# EAGLE design Nodo_actuador_wa4_v1_b (EAGLE 8.5.1)

## Sheet 1 of 5: FUENTES
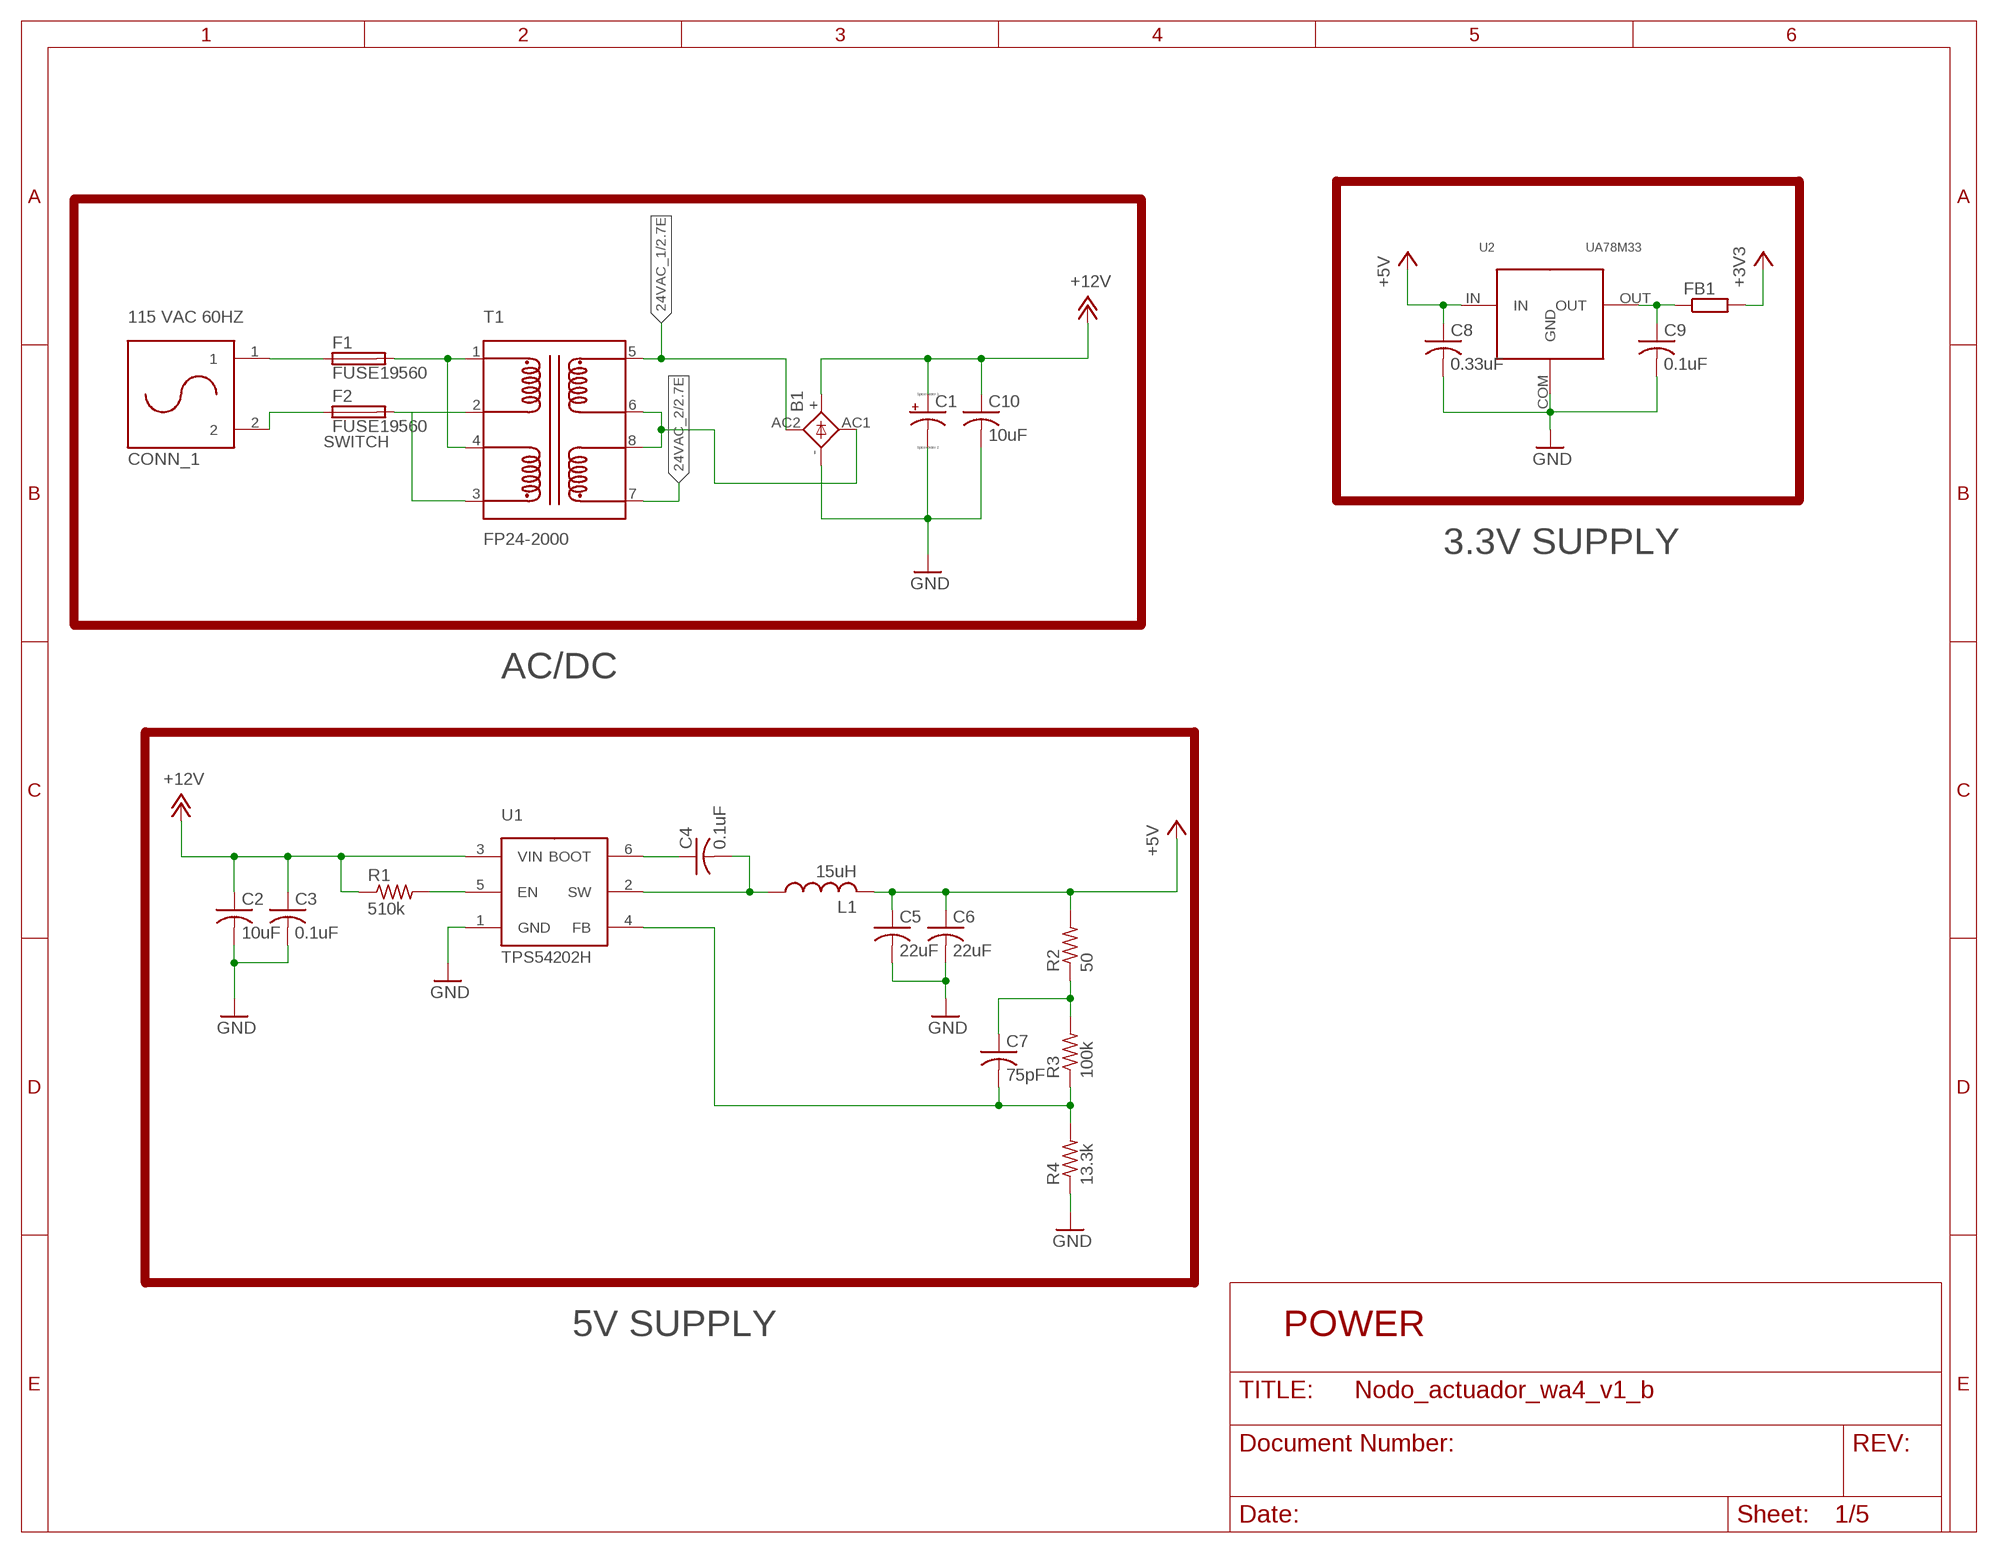
[diagram p0: schematic, sheet 1]

### Parts
B1  GBU4  [GBU4S]
C1  CPOL-USE5-13  [E5-13]
C2  10uF  C-USC0805  [C0805]
C3  0.1uF  C-USC0805  [C0805]
C4  0.1uF  C-USC0805  [C0805]
C5  22uF  C-USC0805  [C0805]
C6  22uF  C-USC0805  [C0805]
C7  75pF  C-USC0805  [C0805]
C8  0.33uF  C-USC0805  [C0805]
C9  0.1uF  C-USC0805  [C0805]
C10  10uF  C-USC0805  [C0805]
CONN_1  115 VAC 60HZ  2570-2210  [2570-2210]
F1  FUSE19560  [19560]
F2  FUSE19560  [19560]
FB1  R-EU_M0805  [M0805]
L1  15uH  VLS5045EX  [VLS5045]
R1  510k  R-US_R0805  [R0805]
R2  50  R-US_R0805  [R0805]
R3  100k  R-US_R0805  [R0805]
R4  13.3k  R-US_R0805  [R0805]
T1  FP24-2000  [FP24-2000]
U1  TPS54202H  [SOT-23-6]
U2  UA78M33  [UA78XX]

### Nets
24VAC_1: B1.AC2(AC1) T1.5 ; also sheet 2
24VAC_2: T1.7 ; also sheet 2
+3V3: FB1.2 ; also sheet 2,3,4
+5V: C5.1 C6.1 C8.1 L1.2 R2.2 U2.IN ; also sheet 2,3,5
+12V: B1.+ C1.+ C2.1 C3.1 C10.1 R1.1 U1.3(VIN) ; also sheet 4
GND: B1.- C1.- C2.2 C3.2 C5.2 C6.2 C8.2 C9.2 C10.2 R4.1 U1.1(GND) U2.COM(GND) ; also sheet 2,3,4,5
N$1: F1.2 T1.1 T1.4
N$2: F2.2 T1.2 T1.3
N$3: B1.AC1(AC2) T1.6 T1.8
N$4: C4.1 U1.6(BOOT)
N$5: C4.2 L1.1 U1.2(SW)
N$6: R1.2 U1.5(EN)
N$8: C7.1 R2.1 R3.2
N$9: C7.2 R3.1 R4.2 U1.4(FB)
N$15: CONN_1.1 F1.1
N$49: CONN_1.2 F2.1
N$53: C9.1 FB1.1 U2.OUT

### Notes on the sheet
- SWITCH
- 3.3V SUPPLY
- AC/DC
- 5V SUPPLY | POWER

## Sheet 2 of 5: VALVULAS Y BOTONERA
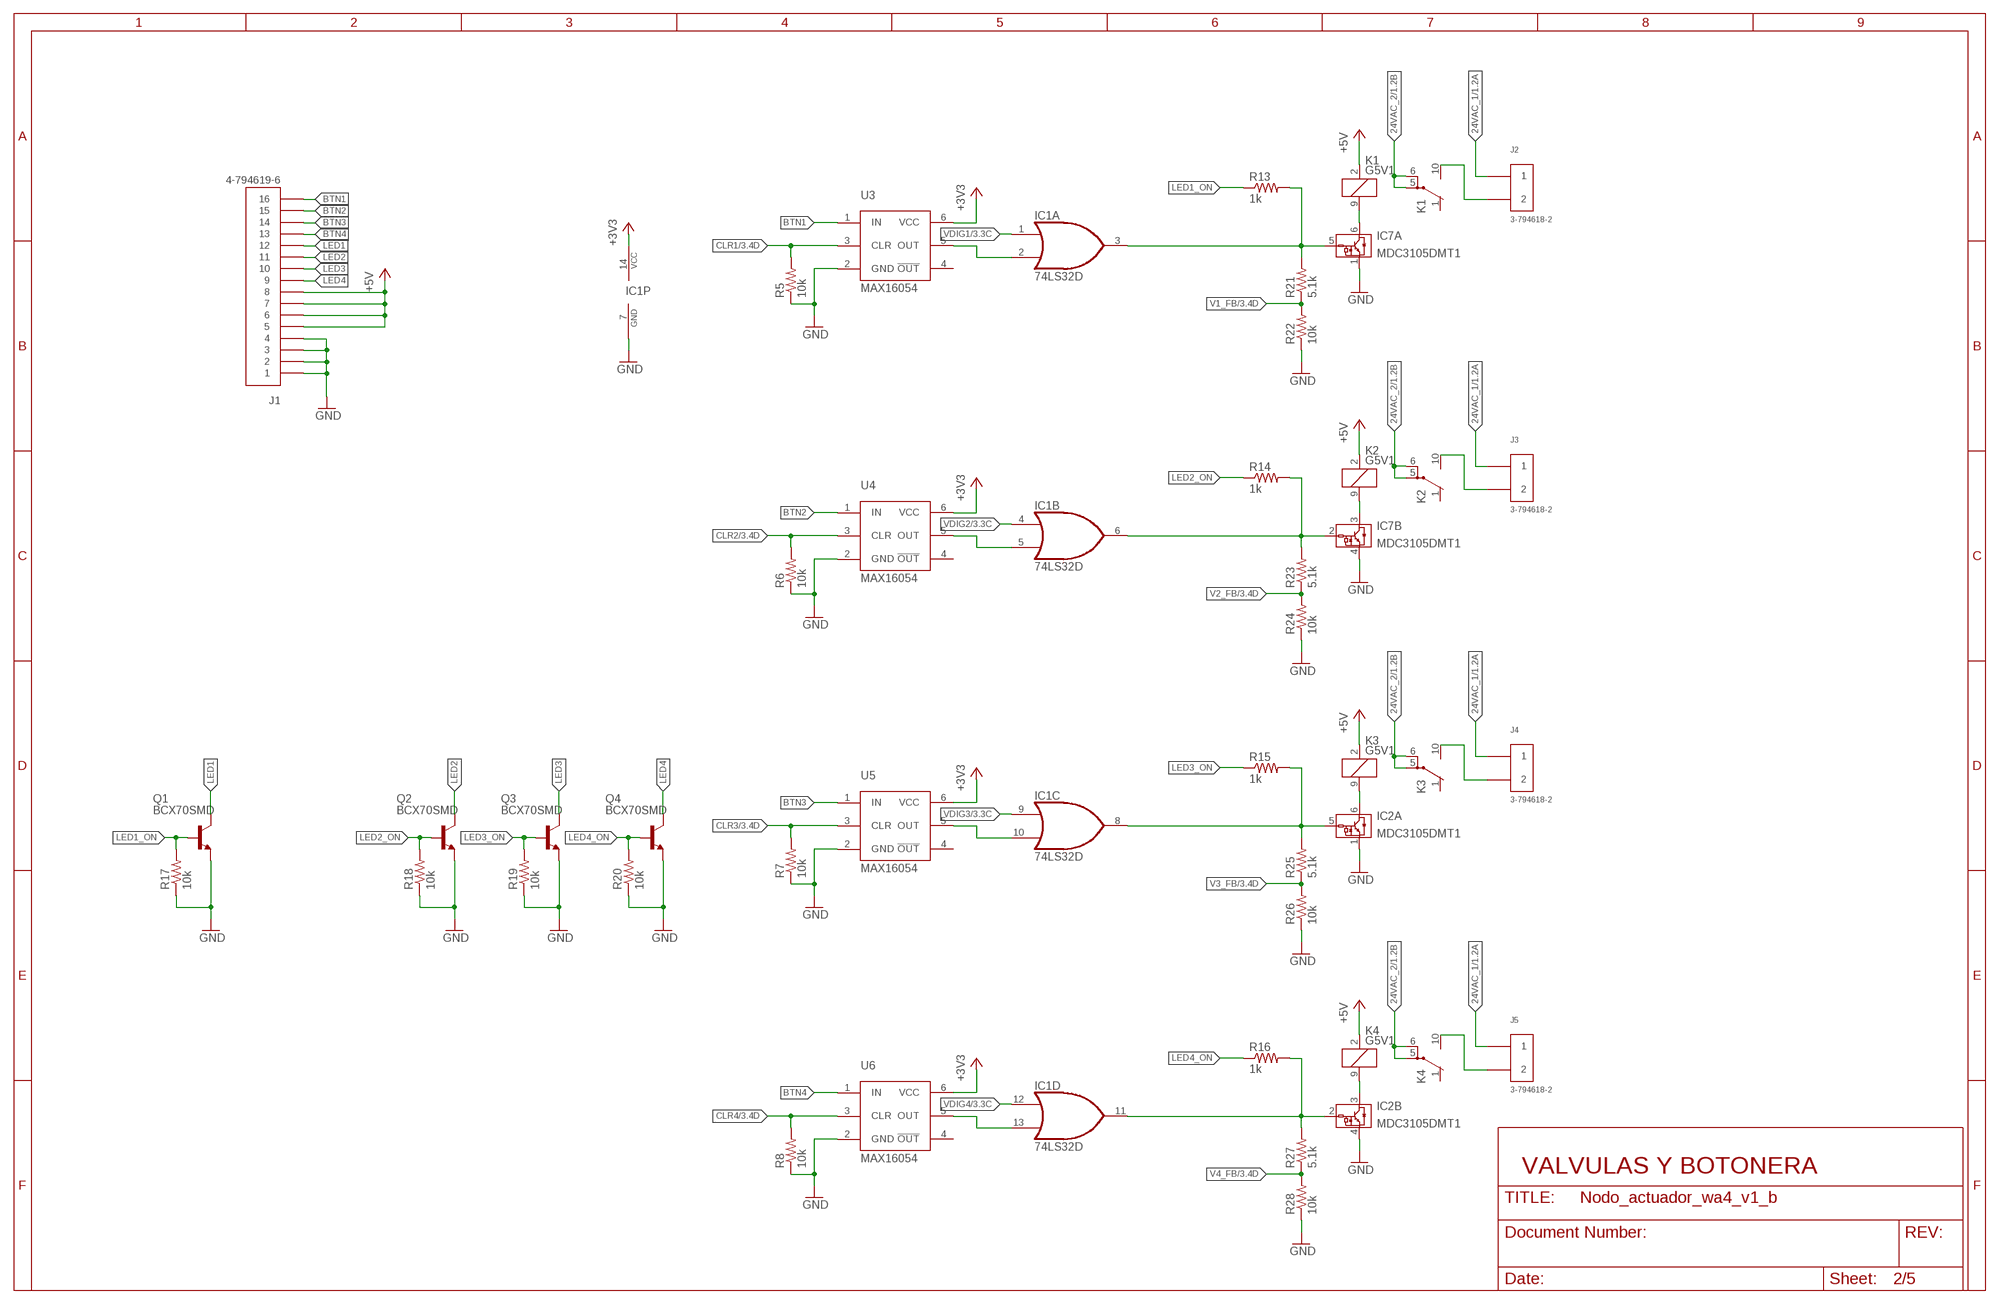
[diagram p1: schematic, sheet 2]

### Parts
IC1  74LS32D  [SO14]
IC2  MDC3105DMT1  [SC-74]
IC7  MDC3105DMT1  [SC-74]
J1  4-794619-6  [4-794619-6]
J2  3-794618-2  [3-794618-2]
J3  3-794618-2  [3-794618-2]
J4  3-794618-2  [3-794618-2]
J5  3-794618-2  [3-794618-2]
K1  G5V1  [G5V1]
K2  G5V1  [G5V1]
K3  G5V1  [G5V1]
K4  G5V1  [G5V1]
Q1  BCX70SMD  [SOT23]
Q2  BCX70SMD  [SOT23]
Q3  BCX70SMD  [SOT23]
Q4  BCX70SMD  [SOT23]
R5  10k  R-US_R0805  [R0805]
R6  10k  R-US_R0805  [R0805]
R7  10k  R-US_R0805  [R0805]
R8  10k  R-US_R0805  [R0805]
R13  1k  R-US_R0805  [R0805]
R14  1k  R-US_R0805  [R0805]
R15  1k  R-US_R0805  [R0805]
R16  1k  R-US_R0805  [R0805]
R17  10k  R-US_R0805  [R0805]
R18  10k  R-US_R0805  [R0805]
R19  10k  R-US_R0805  [R0805]
R20  10k  R-US_R0805  [R0805]
R21  5.1k  R-US_R0805  [R0805]
R22  10k  R-US_R0805  [R0805]
R23  5.1k  R-US_R0805  [R0805]
R24  10k  R-US_R0805  [R0805]
R25  5.1k  R-US_R0805  [R0805]
R26  10k  R-US_R0805  [R0805]
R27  5.1k  R-US_R0805  [R0805]
R28  10k  R-US_R0805  [R0805]
U3  MAX16054  [SOT-23-6]
U4  MAX16054  [SOT-23-6]
U5  MAX16054  [SOT-23-6]
U6  MAX16054  [SOT-23-6]

### Nets
24VAC_1: J2.1 J3.1 J4.1 J5.1 ; also sheet 1
24VAC_2: K1.5(2:P) K1.6(2:P) K2.5(2:P) K2.6(2:P) K3.5(2:P) K3.6(2:P) K4.5(2:P) K4.6(2:P) ; also sheet 1
+3V3: IC1.14(P:VCC) U3.6(VCC) U4.6(VCC) U5.6(VCC) U6.6(VCC) ; also sheet 1,3,4
+5V: J1.5 J1.6 J1.7 J1.8 K1.2 K2.2 K3.2 K4.2 ; also sheet 1,3,5
BTN1: J1.16 U3.1(IN)
BTN2: J1.15 U4.1(IN)
BTN3: J1.14 U5.1(IN)
BTN4: J1.13 U6.1(IN)
CLR1: R5.2 U3.3(CLR) ; also sheet 3
CLR2: R6.2 U4.3(CLR) ; also sheet 3
CLR3: R7.2 U5.3(CLR) ; also sheet 3
CLR4: R8.2 U6.3(CLR) ; also sheet 3
GND: IC1.7(P:GND) IC2.1(A:GND) IC2.4(B:GND) IC7.1(A:GND) IC7.4(B:GND) J1.1 J1.2 J1.3 J1.4 Q1.2(E) Q2.2(E) Q3.2(E) Q4.2(E) R5.1 R6.1 R7.1 R8.1 R17.1 R18.1 R19.1 R20.1 R22.1 R24.1 R26.1 R28.1 U3.2(GND) U4.2(GND) U5.2(GND) U6.2(GND) ; also sheet 1,3,4,5
LED1: J1.12 Q1.3(C)
LED1_ON: Q1.1(B) R13.1 R17.2
LED2: J1.11 Q2.3(C)
LED2_ON: Q2.1(B) R14.1 R18.2
LED3: J1.10 Q3.3(C)
LED3_ON: Q3.1(B) R15.1 R19.2
LED4: J1.9 Q4.3(C)
LED4_ON: Q4.1(B) R16.1 R20.2
N$7: IC1.2(A:I1) U3.5(OUT)
N$10: IC1.5(B:I1) U4.5(OUT)
N$11: IC1.10(C:I1) U5.5(OUT)
N$12: IC1.13(D:I1) U6.5(OUT)
N$13: IC1.3(A:O) IC7.5(A:VIN) R13.2 R21.2
N$14: IC7.6(A:VOUT) K1.9
N$16: IC7.3(B:VOUT) K2.9
N$17: IC1.8(C:O) IC2.5(A:VIN) R15.2 R25.2
N$18: IC2.6(A:VOUT) K3.9
N$19: IC1.11(D:O) IC2.2(B:VIN) R16.2 R27.2
N$20: IC2.3(B:VOUT) K4.9
N$24: J2.2 K1.10(2:S)
N$25: J3.2 K2.10(2:S)
N$26: J4.2 K3.10(2:S)
N$27: J5.2 K4.10(2:S)
N$50: IC1.6(B:O) IC7.2(B:VIN) R14.2 R23.2
V1_FB: R21.1 R22.2 ; also sheet 3
V2_FB: R23.1 R24.2 ; also sheet 3
V3_FB: R25.1 R26.2 ; also sheet 3
V4_FB: R27.1 R28.2 ; also sheet 3
VDIG1: IC1.1(A:I0) ; also sheet 3
VDIG2: IC1.4(B:I0) ; also sheet 3
VDIG3: IC1.9(C:I0) ; also sheet 3
VDIG4: IC1.12(D:I0) ; also sheet 3
Unconnected: K1.1(2:O) K2.1(2:O) K3.1(2:O) K4.1(2:O) U3.4(!OUT) U4.4(!OUT) U5.4(!OUT) U6.4(!OUT)

### Notes on the sheet
- VALVULAS Y BOTONERA

## Sheet 3 of 5: ARDUINO Y COMUNICACION
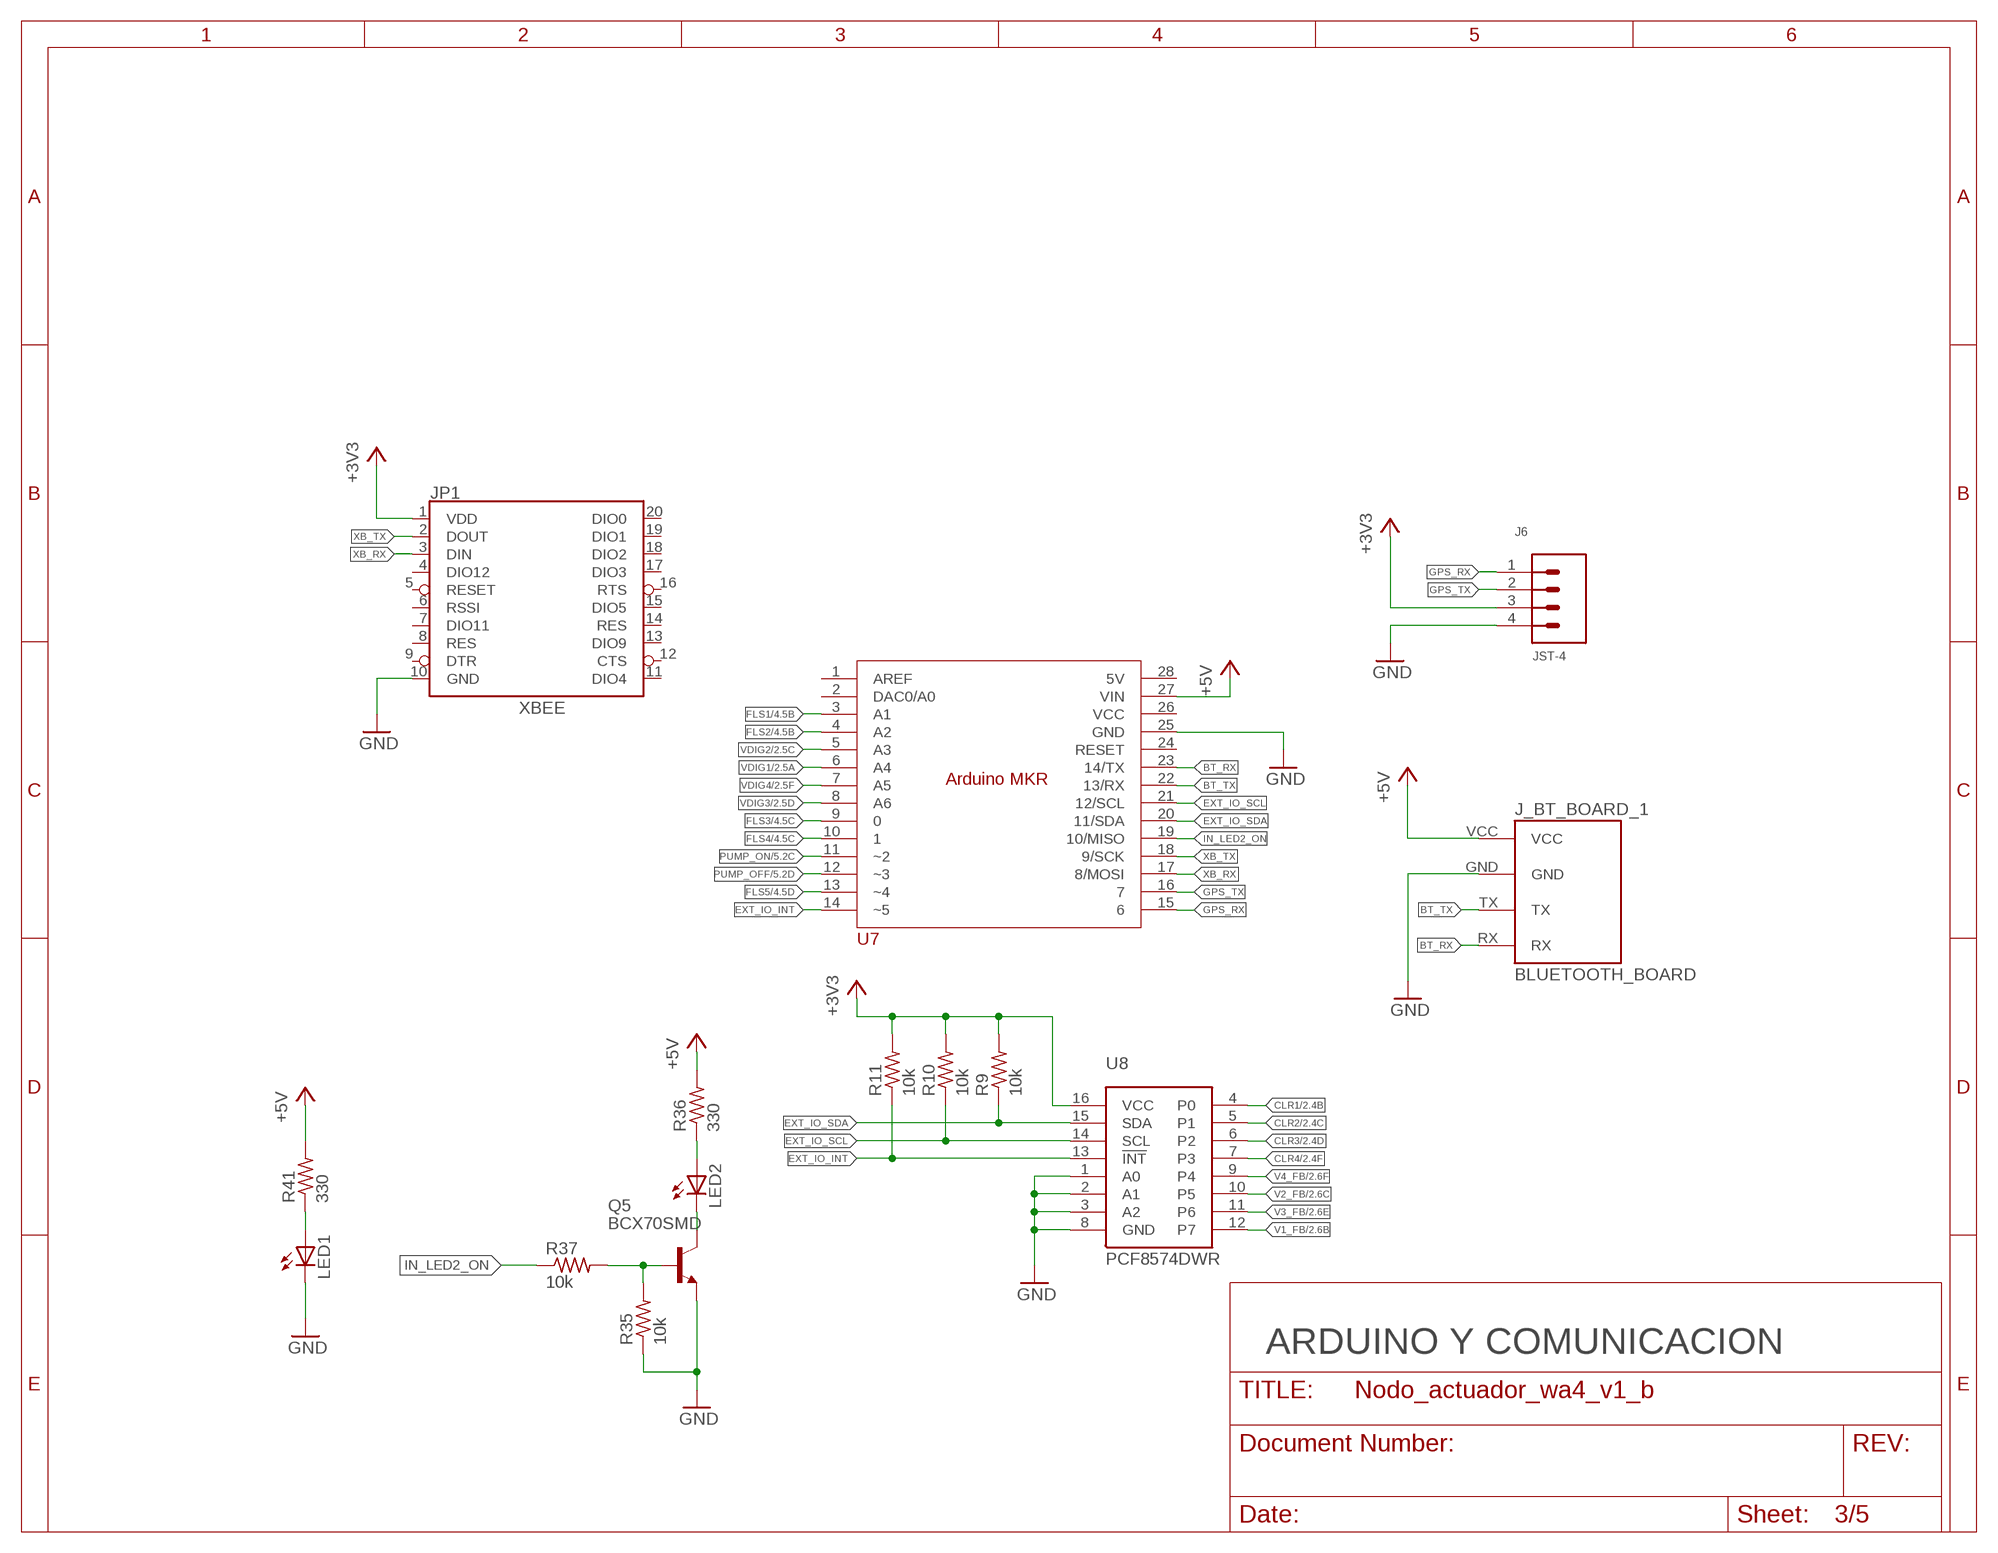
[diagram p2: schematic, sheet 3]

### Parts
J6  JST-4  [JST-4]
J_BT_BOARD_1  BLUETOOTH_BOARD  [BT_BOARD_FOOTPRINT]
JP1  XBEESILK  [XBEE-SILK]
LED1  LEDCHIP-LED0805  [CHIP-LED0805]
LED2  LEDCHIP-LED0805  [CHIP-LED0805]
Q5  BCX70SMD  [SOT23]
R9  10k  R-US_R0805  [R0805]
R10  10k  R-US_R0805  [R0805]
R11  10k  R-US_R0805  [R0805]
R35  10k  R-US_R0805  [R0805]
R36  330  R-US_R0805  [R0805]
R37  10k  R-US_R0805  [R0805]
R41  330  R-US_R0805  [R0805]
U7  ARDUINO_MKR  [ARDUINO_MKR]
U8  PCF8574DWR  [SOIC16_1]

### Nets
+3V3: J6.3 JP1.1(VDD) R9.2 R10.2 R11.2 U8.16(VCC) ; also sheet 1,2,4
+5V: J_BT_BOARD_1.VCC R36.2 R41.2 U7.27(VIN) ; also sheet 1,2,5
BT_RX: J_BT_BOARD_1.RX U7.23(14/TX)
BT_TX: J_BT_BOARD_1.TX U7.22(13/RX)
CLR1: U8.4(P0) ; also sheet 2
CLR2: U8.5(P1) ; also sheet 2
CLR3: U8.6(P2) ; also sheet 2
CLR4: U8.7(P3) ; also sheet 2
EXT_IO_INT: R11.1 U7.14(~5) U8.13(!INT)
EXT_IO_SCL: R10.1 U7.21(12/SCL) U8.14(SCL)
EXT_IO_SDA: R9.1 U7.20(11/SDA) U8.15(SDA)
FLS1: U7.3(A1) ; also sheet 4
FLS2: U7.4(A2) ; also sheet 4
FLS3: U7.9 ; also sheet 4
FLS4: U7.10 ; also sheet 4
FLS5: U7.13(~4) ; also sheet 4
GND: J6.4 J_BT_BOARD_1.GND JP1.10(GND) LED1.C Q5.2(E) R35.1 U7.25(GND) U8.1(A0) U8.2(A1) U8.3(A2) U8.8(GND) ; also sheet 1,2,4,5
GPS_RX: J6.1 U7.15
GPS_TX: J6.2 U7.16
IN_LED2_ON: R37.1 U7.19(10/MISO)
N$38: LED2.A R36.1
N$39: LED2.C Q5.3(C)
N$40: LED1.A R41.1
N$48: Q5.1(B) R35.2 R37.2
PUMP_OFF: U7.12(~3) ; also sheet 5
PUMP_ON: U7.11(~2) ; also sheet 5
V1_FB: U8.12(P7) ; also sheet 2
V2_FB: U8.10(P5) ; also sheet 2
V3_FB: U8.11(P6) ; also sheet 2
V4_FB: U8.9(P4) ; also sheet 2
VDIG1: U7.6(A4) ; also sheet 2
VDIG2: U7.5(A3) ; also sheet 2
VDIG3: U7.8(A6) ; also sheet 2
VDIG4: U7.7(A5) ; also sheet 2
XB_RX: JP1.3(DIN) U7.17(8/MOSI)
XB_TX: JP1.2(DOUT) U7.18(9/SCK)
Unconnected: JP1.4(DIO12) JP1.5(RESET) JP1.6(RSSI) JP1.7(DIO11) JP1.8(RES) JP1.9(DTR) JP1.11(DIO4) JP1.12(CTS) JP1.13(DIO9) JP1.14(RES) JP1.15(DIO5) JP1.16(RTS) JP1.17(DIO3) JP1.18(DIO2) JP1.19(DIO1) JP1.20(DIO0) U7.1(AREF) U7.2(DAC0/A0) U7.24(RESET) U7.26(VCC) U7.28(5V)

### Notes on the sheet
- XBEE
- ARDUINO Y COMUNICACION

## Sheet 4 of 5: SENSORES
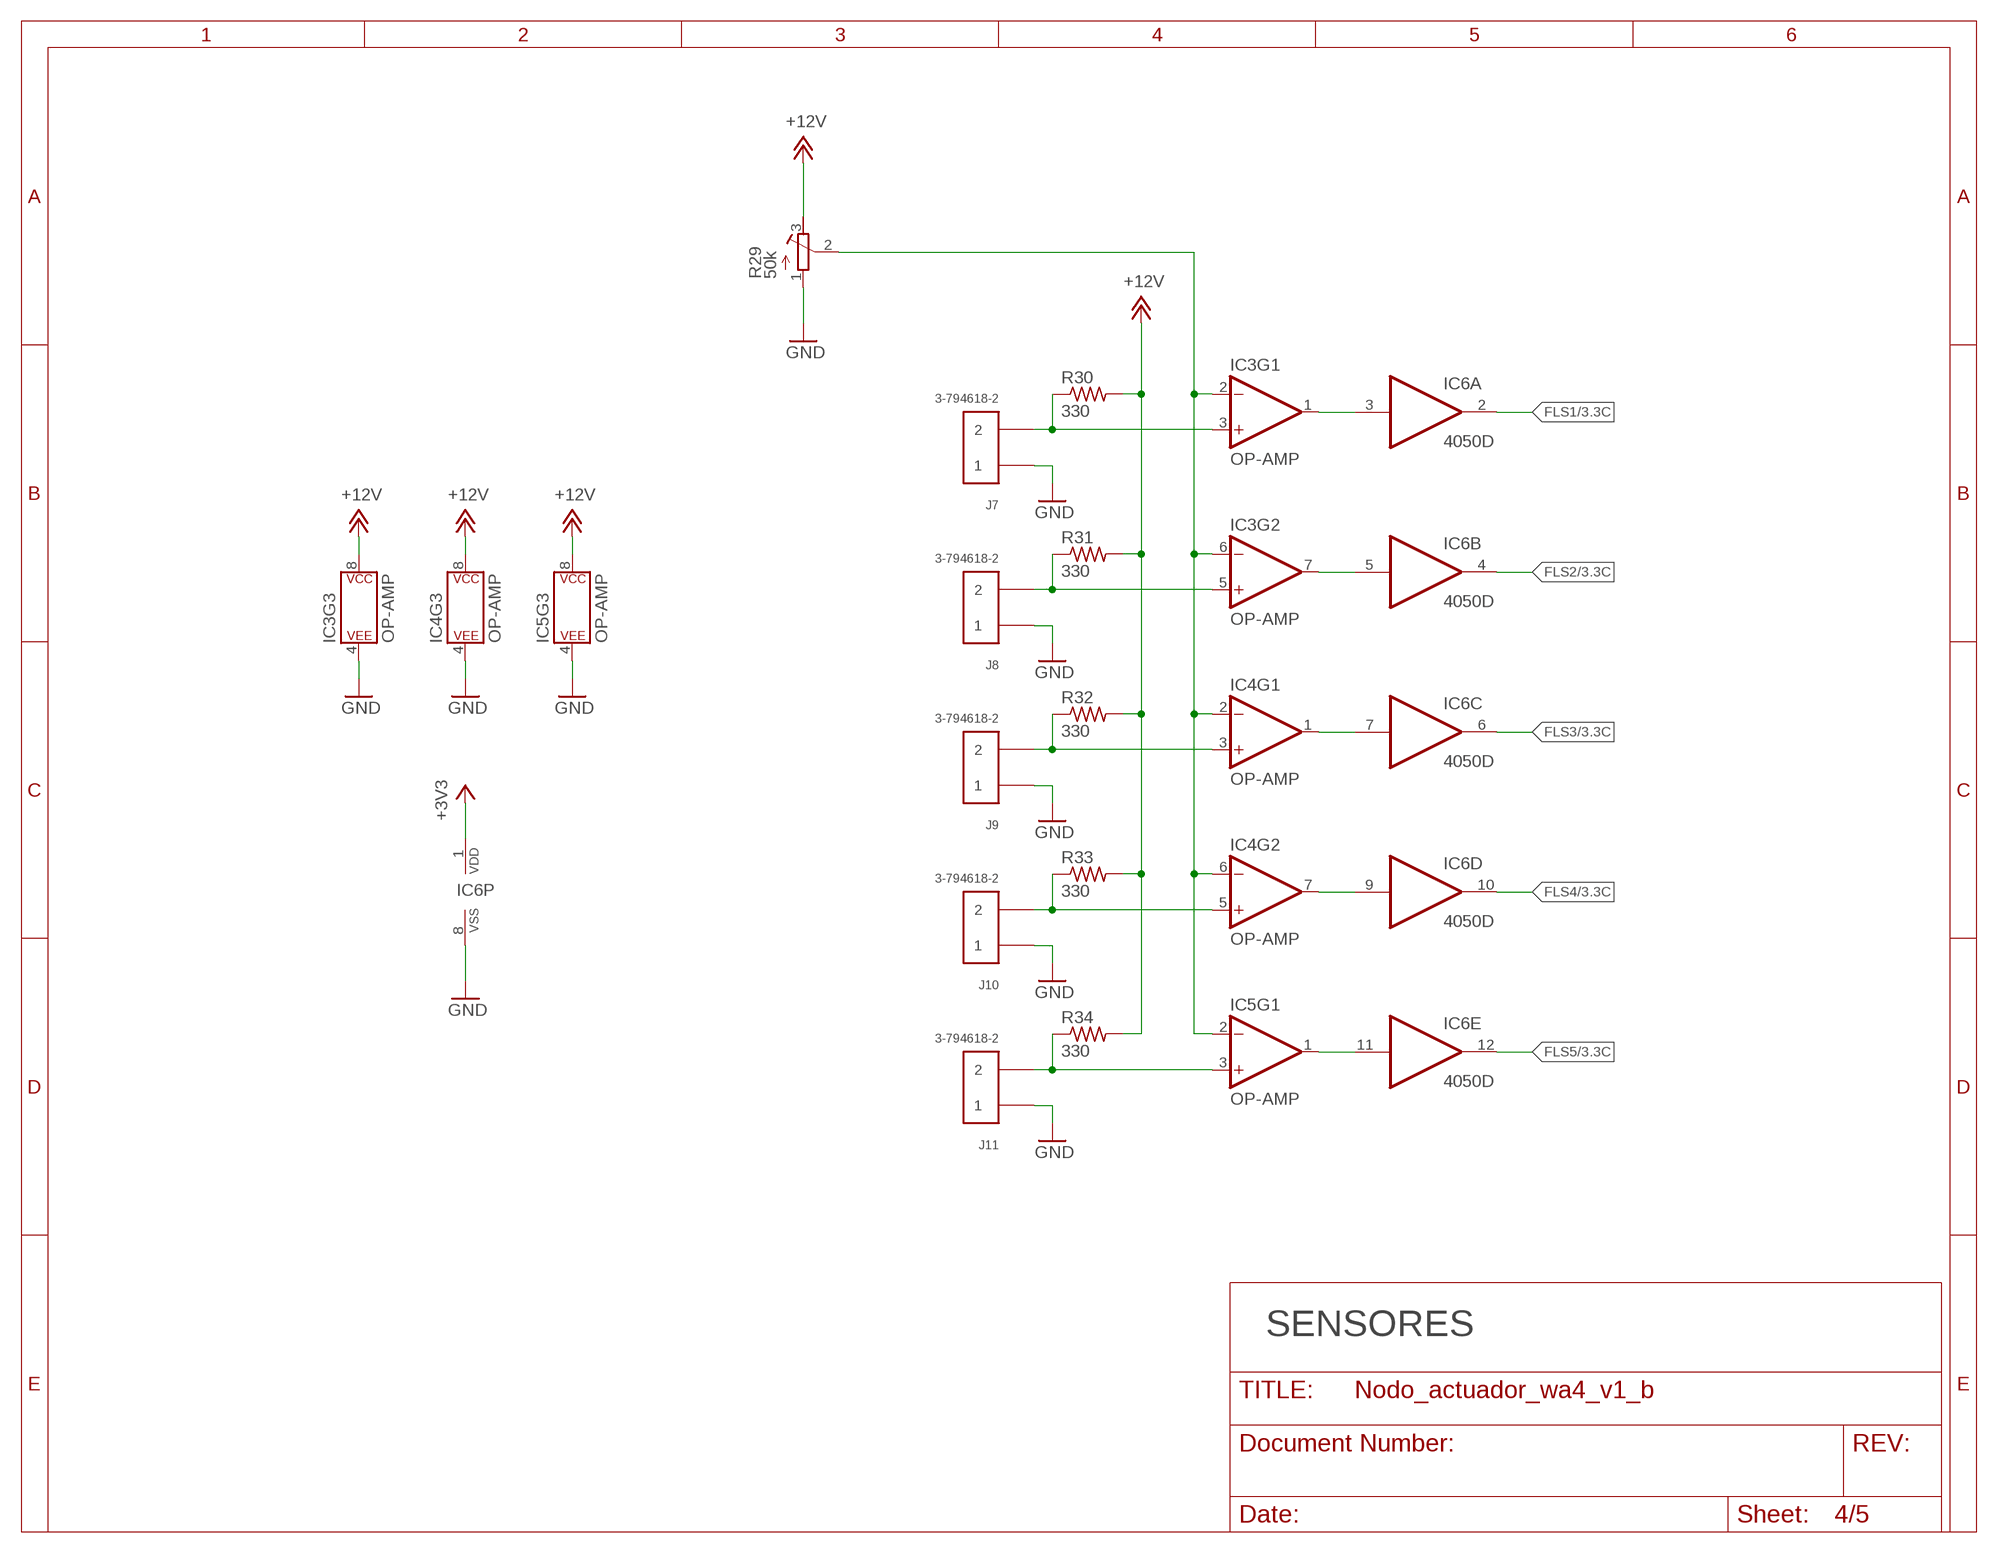
[diagram p3: schematic, sheet 4]

### Parts
IC3  OP-AMP  OPAMP-DUALU  [SO08]
IC4  OP-AMP  OPAMP-DUALU  [SO08]
IC5  OP-AMP  OPAMP-DUALU  [SO08]
IC6  4050D  [SO16]
J7  3-794618-2  [3-794618-2]
J8  3-794618-2  [3-794618-2]
J9  3-794618-2  [3-794618-2]
J10  3-794618-2  [3-794618-2]
J11  3-794618-2  [3-794618-2]
R29  50k  R-TRIMM3224W  [RTRIM3224W]
R30  330  R-US_R0805  [R0805]
R31  330  R-US_R0805  [R0805]
R32  330  R-US_R0805  [R0805]
R33  330  R-US_R0805  [R0805]
R34  330  R-US_R0805  [R0805]

### Nets
+3V3: IC6.1(P:VDD) ; also sheet 1,2,3
+12V: IC3.8(P$V+) IC4.8(P$V+) IC5.8(P$V+) R29.3(E) R30.2 R31.2 R32.2 R33.2 R34.2 ; also sheet 1
FLS1: IC6.2(A:O) ; also sheet 3
FLS2: IC6.4(B:O) ; also sheet 3
FLS3: IC6.6(C:O) ; also sheet 3
FLS4: IC6.10(D:O) ; also sheet 3
FLS5: IC6.12(E:O) ; also sheet 3
GND: IC3.4(P$V-) IC4.4(P$V-) IC5.4(P$V-) IC6.8(P:VSS) J7.1 J8.1 J9.1 J10.1 J11.1 R29.1(A) ; also sheet 1,2,3,5
N$28: IC3.3(+IN) J7.2 R30.1
N$29: IC3.5(+IN) J8.2 R31.1
N$30: IC4.3(+IN) J9.2 R32.1
N$31: IC4.5(+IN) J10.2 R33.1
N$32: IC5.3(+IN) J11.2 R34.1
N$33: IC3.1(OUT) IC6.3(A:I)
N$34: IC3.7(OUT) IC6.5(B:I)
N$35: IC4.1(OUT) IC6.7(C:I)
N$36: IC4.7(OUT) IC6.9(D:I)
N$37: IC5.1(OUT) IC6.11(E:I)
SENSOR_VREF: IC3.2(-IN) IC3.6(-IN) IC4.2(-IN) IC4.6(-IN) IC5.2(-IN) R29.2(S)
Unconnected: IC5.5(+IN) IC5.6(-IN) IC5.7(OUT) IC6.14(F:I) IC6.15(F:O)

### Notes on the sheet
- SENSORES

## Sheet 5 of 5: BOMBA
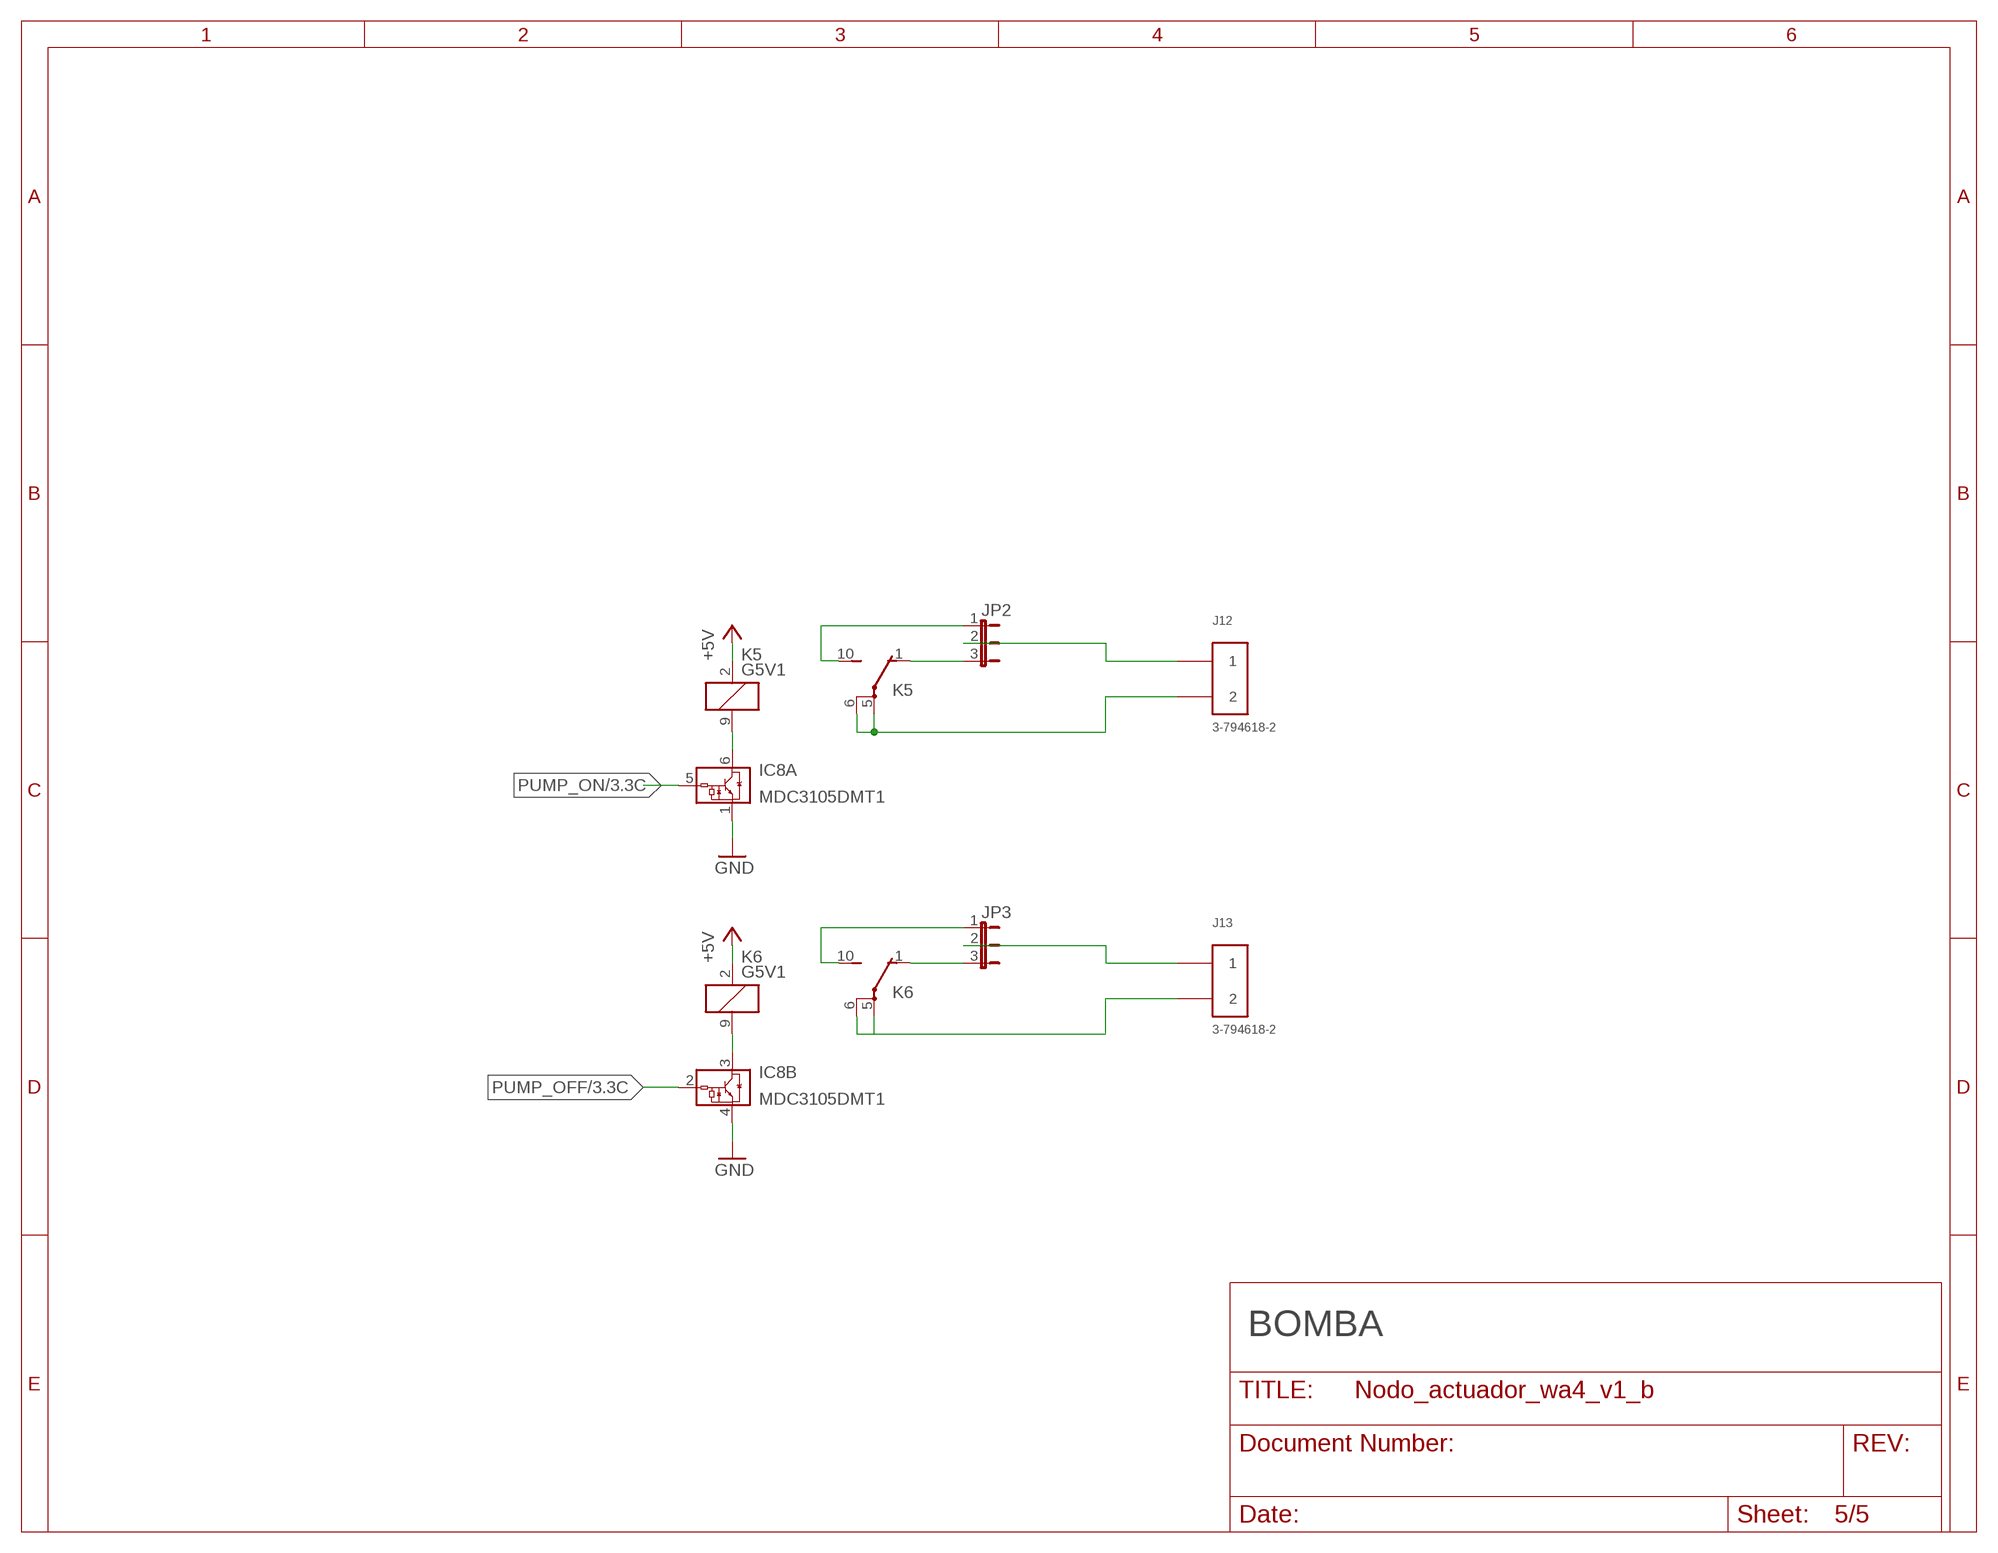
[diagram p4: schematic, sheet 5]

### Parts
IC8  MDC3105DMT1  [SC-74]
J12  3-794618-2  [3-794618-2]
J13  3-794618-2  [3-794618-2]
JP2  JP2E  [JP2]
JP3  JP2E  [JP2]
K5  G5V1  [G5V1]
K6  G5V1  [G5V1]

### Nets
+5V: K5.2 K6.2 ; also sheet 1,2,3
GND: IC8.1(A:GND) IC8.4(B:GND) ; also sheet 1,2,3,4
N$21: IC8.6(A:VOUT) K5.9
N$22: JP2.1 K5.10(2:S)
N$23: JP2.3 K5.1(2:O)
N$41: J12.1 JP2.2
N$42: J12.2 K5.5(2:P) K5.6(2:P)
N$43: J13.1 JP3.2
N$44: J13.2 K6.5(2:P) K6.6(2:P)
N$45: JP3.1 K6.10(2:S)
N$46: JP3.3 K6.1(2:O)
N$47: IC8.3(B:VOUT) K6.9
PUMP_OFF: IC8.2(B:VIN) ; also sheet 3
PUMP_ON: IC8.5(A:VIN) ; also sheet 3

### Notes on the sheet
- BOMBA

## Library data of the parts
B1 = rectifier:GBU4: GENERAL INSTRUMENT RECTIFIER
C1 = resistor:CPOL-US: POLARIZED CAPACITOR, American symbol
C2-C10 = resistor:C-US: CAPACITOR, American symbol
CONN_1 = actuador:2570-2210
F1 F2 = fuse:FUSE: Fuse; MPN: 56000001009; OC_FARNELL: 1185363; OC_NEWARK: 98K6125
FB1 = resistor:R-EU_: RESISTOR, European symbol
IC1 = 74xx-us:74*32: Quad 2-input OR gate
IC2 IC7 IC8 = on-semiconductor:MDC3105DMT1: Integrated Relay, Inductive Load Driver Sopurce: U6 OnSemi Inductive Load Driver MDC3105-D.PDF; MPN: MDC3105DMT1G; OC_FARNELL: unknown; OC_NEWARK: 04R7836
IC3-IC5 = SparkFun-IC-Amplifiers:OPAMP-DUAL: Generic op-amp footprint This component is for the standard 358 pinning of a dual op-amp From the LM358 datasheet: Pin 1: Output A Pin 2: Inverting Input A Pin 3: Non-Inverting Input A Pin 4: Gnd Pin 5: Non-Inverting Input B Pin 6: Inverting Input B Pin 7: Output B Pin 8: V+; PROD_ID: NA-XXXXX
IC6 = 40xx:4050: Hex non-inverting BUFFER
J1 = actuador:4-794619-6
J2-J5 J7-J13 = actuador:3-794618-2
J6 = actuador:JST-4
J_BT_BOARD_1 = Bluetooth HC-05:BLUETOOTH_BOARD: Bluetooth Board V1.05
JP1 = SparkFun-RF:XBEE: Digi XBee and XBee Pro XBees are tiny blue chips that can communicate wirelessly with each other. They can do simple things, like replacing a couple of wires in serial communication, which is nice when you want to make a remote for your paintball vehicle. SparkFun Products SparkFun XBee Buying Guide <https://www.sparkfun.com/pages/xbee_guide> SparkFun XBee Explorer USB <https://www.sparkfun.com/products/11812> (WRL-11812) Breakout Board for XBee Module <https://www.sparkfun.com/products/8276> (WRL-8276) SparkFun XBee Explorer Regulated <https://www.sparkfun.com/products/11373> (WRL-11373) SparkFun XBee Explorer Dongle <https://www.sparkfun.com/products/11697> (WRL-11697) SparkFun XBee Shield <https://www.sparkfun.com/products/12847> (WRL-12847) SparkFun XBee Explorer Serial <https://www.sparkfun.com/products/13225> (WRL-13225)
JP2 JP3 = jumper:JP2E: JUMPER
K1-K6 = relay:G5V1: RELAY 1 x switch, 0.5 A/125 V AC, 1 A/24 V DC , Omron; MPN: G5V-1-DC24; OC_FARNELL: 9949593; OC_NEWARK: 36M6377
L1 = actuador:VLS5045EX
LED1 LED2 = led:LED: LED OSRAM: - CHIPLED LG R971, LG N971, LY N971, LG Q971, LY Q971, LO R971, LY R971 LH N974, LH R974 LS Q976, LO Q976, LY Q976 LO Q996 - Hyper CHIPLED LW Q18S LB Q993, LB Q99A, LB R99A - SideLED LS A670, LO A670, LY A670, LG A670, LP A670 LB A673, LV A673, LT A673, LW A673 LH A674 LY A675 LS A676, LA A676, LO A676, LY A676, LW A676 LS A679, LY A679, LG A679 - Hyper Micro SIDELED® LS Y876, LA Y876, LO Y876, LY Y876 LT Y87S - SmartLED LW L88C, LW L88S LB L89C, LB L89S, LG L890 LS L89K, LO L89K, LY L89K LS L896, LA L896, LO L896, LY L896 - TOPLED LS T670, LO T670, LY T670, LG T670, LP T670 LSG T670, LSP T670, LSY T670, LOP T670, LYG T670 LG T671, LOG T671, LSG T671 LB T673, LV T673, LT T673, LW T673 LH T674 LS T676, LA T676, LO T676, LY T676, LB T676, LH T676, LSB T676, LW T676 LB T67C, LV T67C, LT T67C, LS T67K, LO T67K, LY T67K, LW E67C LS E67B, LA E67B, LO E67B, LY E67B, LB E67C, LV E67C, LT E67C LW T67C LS T679, LY T679, LG T679 LS T770, LO T770, LY T770, LG T770, LP T770 LB T773, LV T773, LT T773, LW T773 LH T774 LS E675, LA E675, LY E675, LS T675 LS T776, LA T776, LO T776, LY T776, LB T776 LHGB T686 LT T68C, LB T68C - Hyper Mini TOPLED® LB M676 - Mini TOPLED Santana® LG M470 LS M47K, LO M47K, LY M47K Source: http://www.osram.convergy.de LUXEON: - LUMILED® LXK2-PW12-R00, LXK2-PW12-S00, LXK2-PW14-U00, LXK2-PW14-V00 LXK2-PM12-R00, LXK2-PM12-S00, LXK2-PM14-U00 LXK2-PE12-Q00, LXK2-PE12-R00, LXK2-PE12-S00, LXK2-PE14-T00, LXK2-PE14-U00 LXK2-PB12-K00, LXK2-PB12-L00, LXK2-PB12-M00, LXK2-PB14-N00, LXK2-PB14-P00, LXK2-PB14-Q00 LXK2-PR12-L00, LXK2-PR12-M00, LXK2-PR14-Q00, LXK2-PR14-R00 LXK2-PD12-Q00, LXK2-PD12-R00, LXK2-PD12-S00 LXK2-PH12-R00, LXK2-PH12-S00 LXK2-PL12-P00, LXK2-PL12-Q00, LXK2-PL12-R00 Source: www.luxeon.com KINGBRIGHT: KA-3528ASYC Source: www.kingbright.com
Q1-Q5 = transistor-npn:BCX70*: NPN Transistor
R1-R11 R13-R28 R30-R37 R41 = resistor:R-US_: RESISTOR, American symbol
R29 = resistor:R-TRIMM: Trimm resistor
T1 = actuador:FP24-2000
U1 = actuador:TPS54202H
U2 = actuador:UA78M33
U3-U6 = actuador:MAX16054
U7 = Arduino_MKR:ARDUINO_MKR
U8 = actuador:PCF8574DWR

## Board
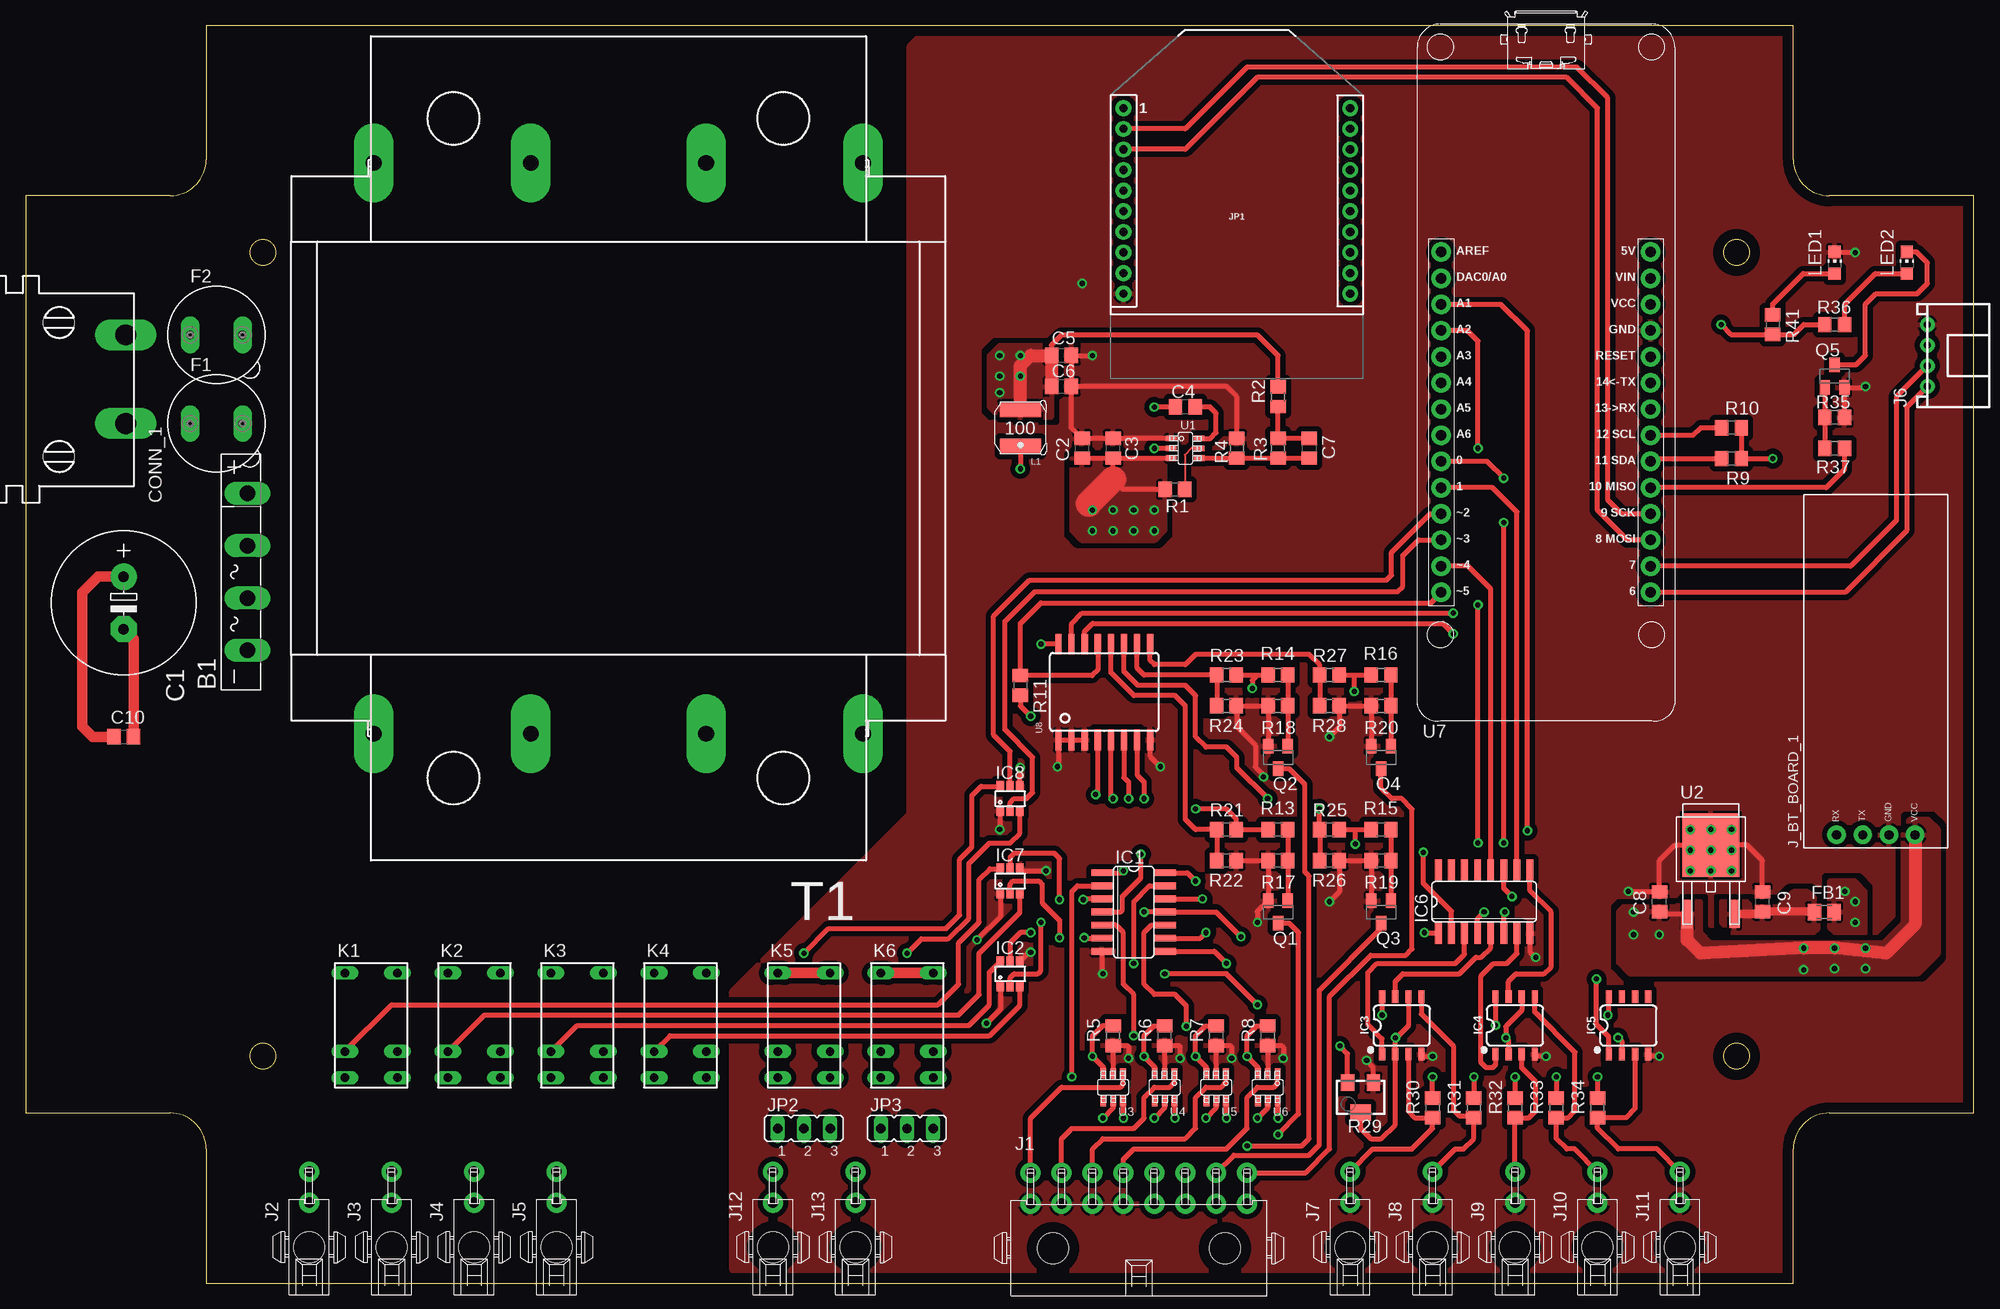
[diagram p5: board, top side]
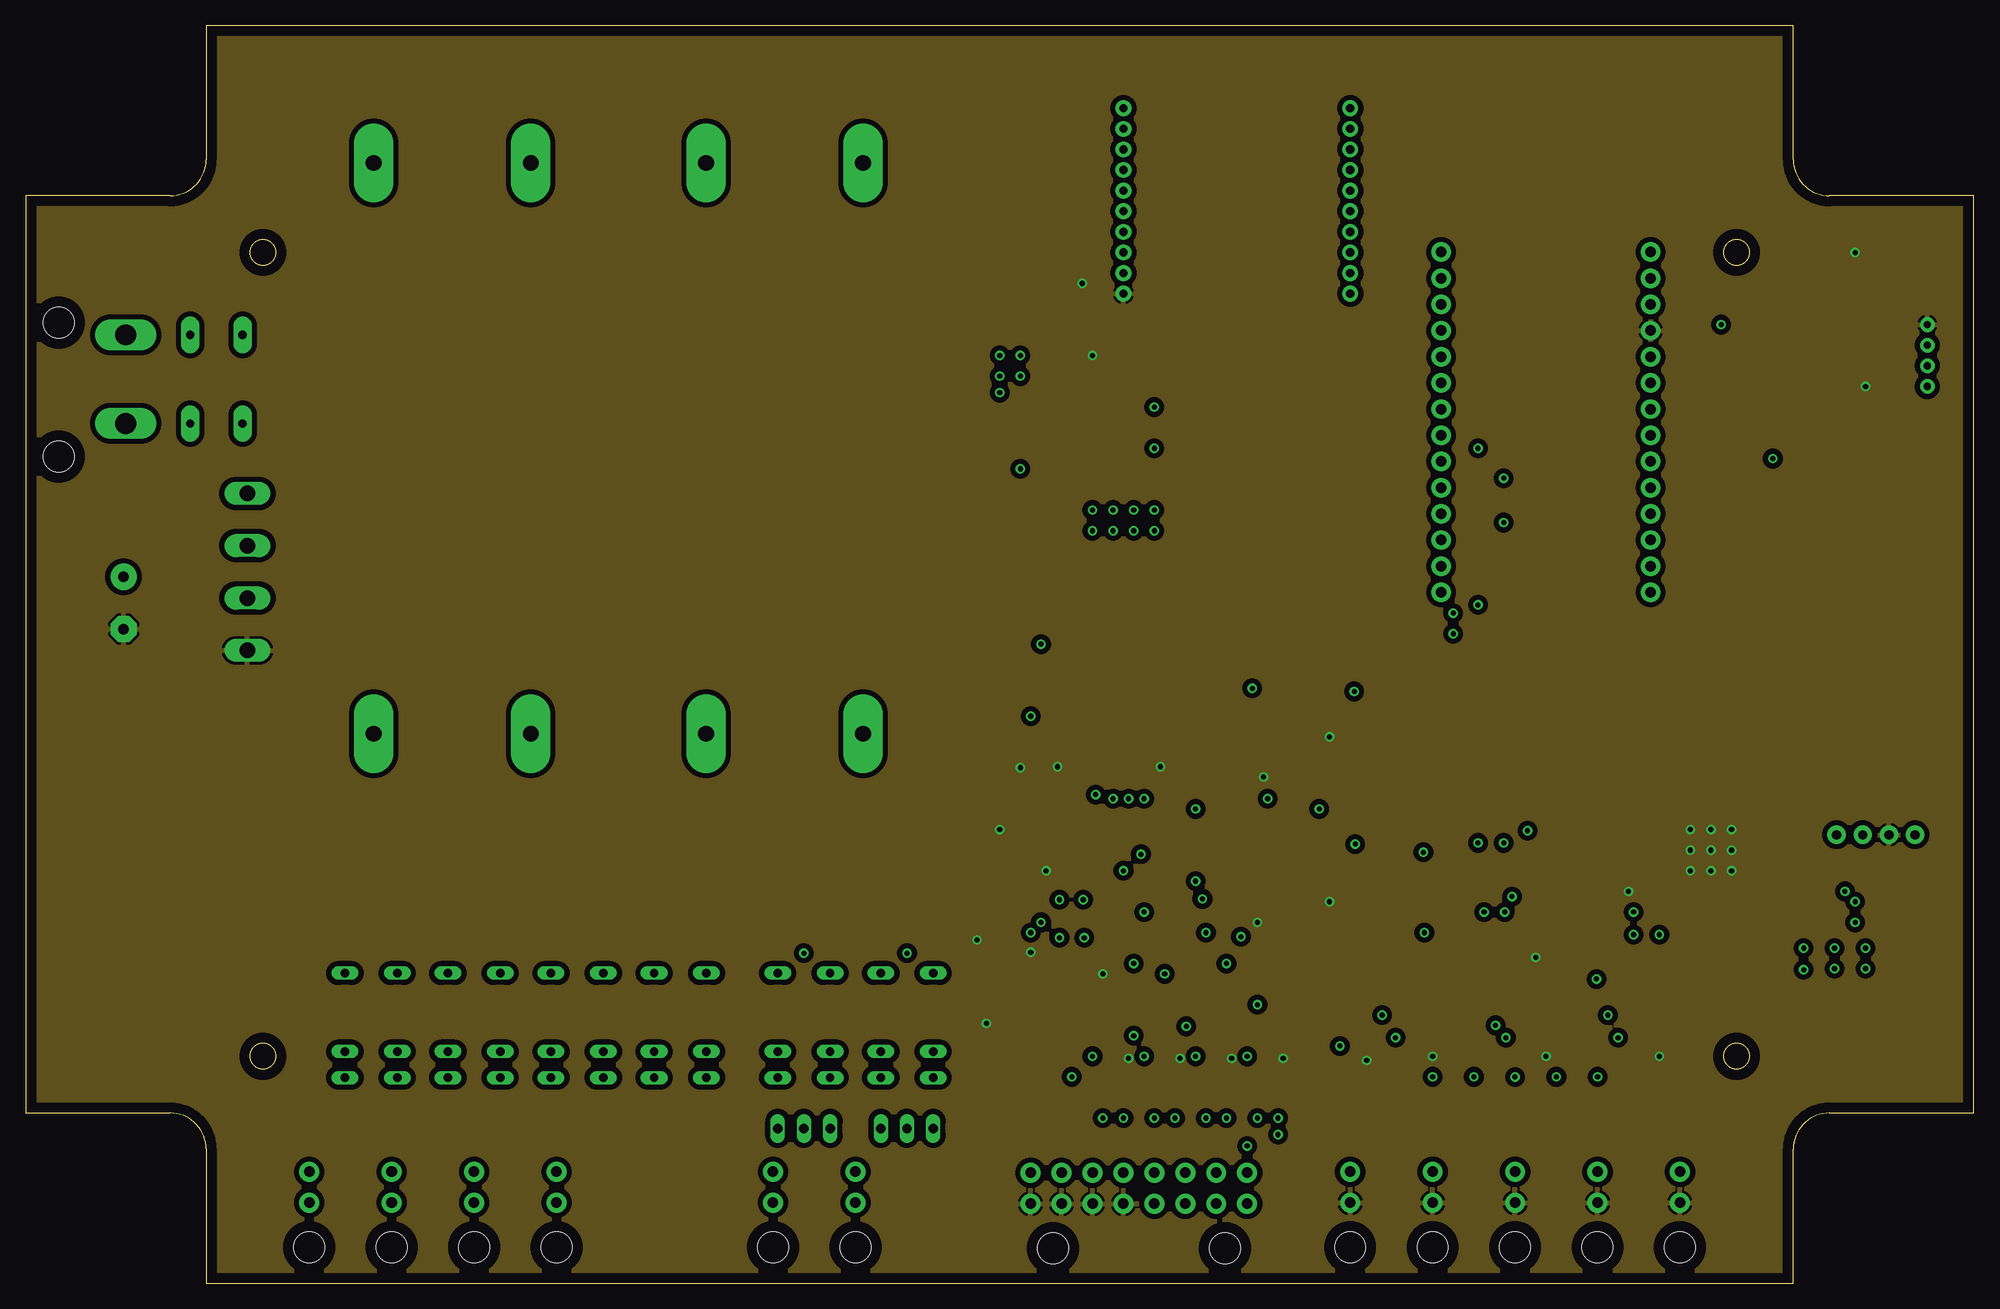
[diagram p6: board, inner layer Ground]
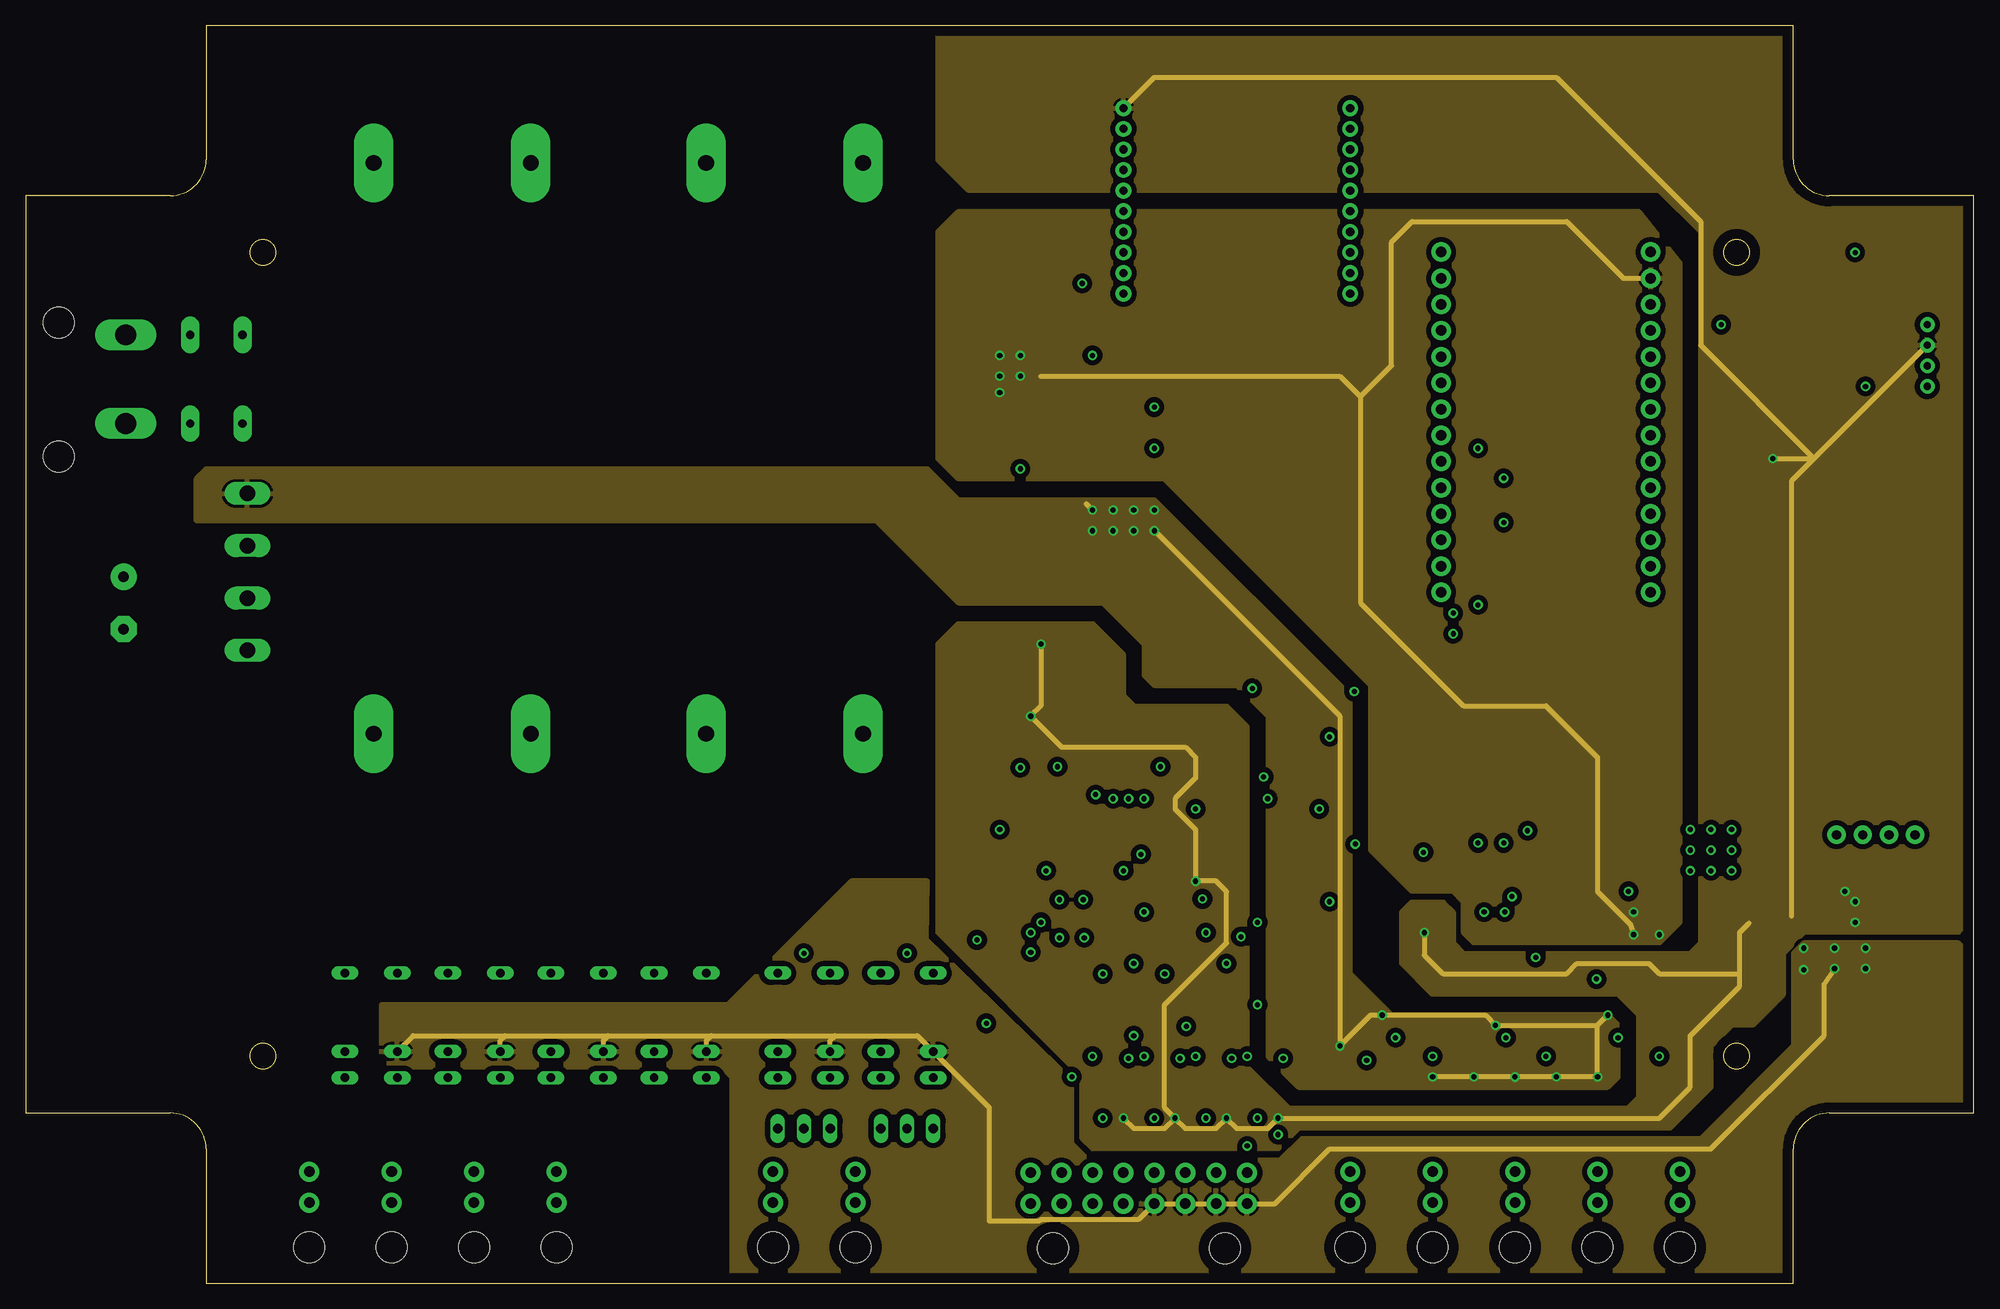
[diagram p7: board, inner layer SUPPLY]
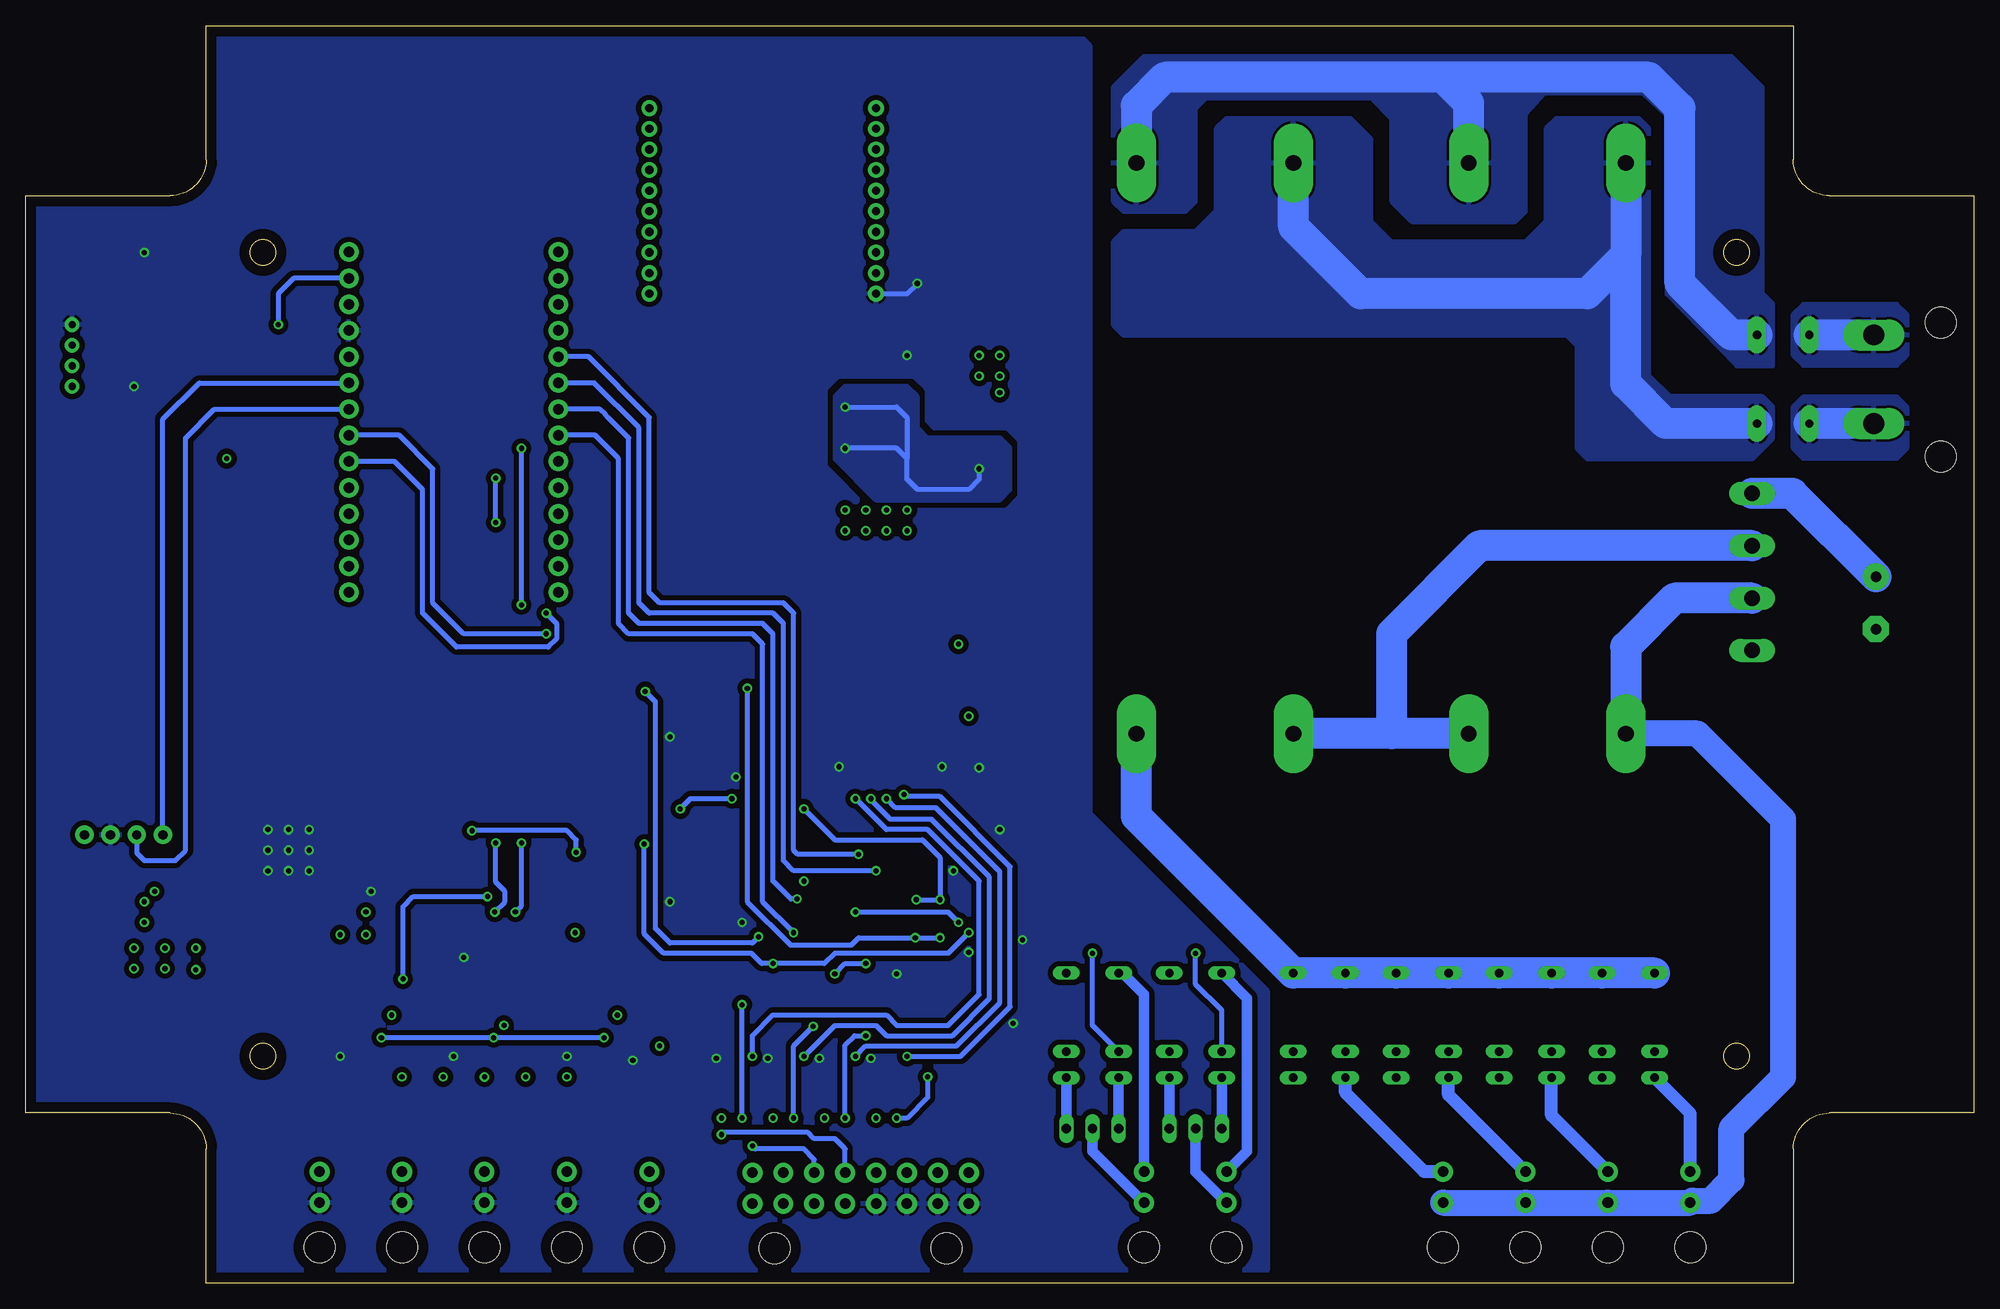
[diagram p8: board, bottom side, seen from below]

Size 189 x 122 mm. Coordinates in mm from the lower left corner, seen from the top.
Outline: 14,105.5 arc90 17.5,109 17.5,122 171.5,122 171.5,109 arc90 175,105.5 189,105.5 189,16.5 175,16.5 arc90 171.5,13 171.5,0 17.5,0 17.5,13 arc90 14,16.5 0,16.5 0,105.5 14,105.5
Outline: circle at 23,22 radius 1.25
Outline: circle at 166,100 radius 1.25
Outline: circle at 23,100 radius 1.25
Outline: circle at 166,22 radius 1.25
Copper layers (1*2+15*16): Top 0.035mm / dielectric 0.4866mm / Ground 0.035mm / dielectric 0.4866mm / SUPPLY 0.035mm / dielectric 0.4866mm / Bottom 0.035mm
Design rules "default *": minimum track width 6mil, minimum drill 0.35mm, track to track 6mil, track to pad 6mil, pad to pad 6mil, via to via 6mil, smd to smd 6mil, copper to edge 40mil, drill to drill 6mil, minimum pad ring 10mil, minimum via ring 8mil, stop-mask expansion 4mil, vias tented up to drill 0.5mm, thermal gap 10mil

### Footprints (pad centres in the part's own frame; a part is rotated, then mirrored left to right if it is on the bottom)
GBU4S = drill 1.499 long: + 7.62,0; - -7.62,0; AC1 2.54,0; AC2 -2.54,0
E5-13 = drill 1.016 pad 2.54: + -2.54,0 | drill 1.016 pad 2.54 octagon: - 2.54,0
C0805 = smd 1.3 x 1.5: 1 -0.95,0; 2 0.95,0
2570-2210 = drill 2 pad 3 long: 1 -3.3,-6.5; 2 5.3,-6.5 | hole 3: -6.5,0; 6.5,0
19560 = drill 0.813 pad 1.778 long: 1 -2.54,0; 2 2.54,0
M0805 = smd 1.3 x 1.6: 1 -0.95,0; 2 0.95,0
SO14 = smd 0.66 x 2.032: 1 -3.81,-3.073; 2 -2.54,-3.073; 3 -1.27,-3.073; 4 0,-3.073; 5 1.27,-3.073; 6 2.54,-3.073; 7 3.81,-3.073; 8 3.81,3.073; 9 2.54,3.073; 10 1.27,3.073; 11 0,3.073; 12 -1.27,3.073; 13 -2.54,3.073; 14 -3.81,3.073
SC-74 = smd 0.7 x 1: 1 -0.95,-1.2; 2 0,-1.2; 3 0.95,-1.2; 4 0.95,1.2; 5 0,1.2; 6 -0.95,1.2
SO08 = smd 0.6 x 1.2: 1 -1.905,-2.8; 2 -0.635,-2.8; 3 0.635,-2.8; 4 1.905,-2.8; 5 1.905,2.8; 6 0.635,2.8; 7 -0.635,2.8; 8 -1.905,2.8
SO16 = smd 0.66 x 2.032: 1 -4.445,-3.073; 2 -3.175,-3.073; 3 -1.905,-3.073; 4 -0.635,-3.073; 5 0.635,-3.073; 6 1.905,-3.073; 7 3.175,-3.073; 8 4.445,-3.073; 9 4.445,3.073; 10 3.175,3.073; 11 1.905,3.073; 12 0.635,3.073; 13 -0.635,3.073; 14 -1.905,3.073; 15 -3.175,3.073; 16 -4.445,3.073
4-794619-6 = drill 1.02 pad 1.93: 1 -10.5,2.8; 2 -7.5,2.8; 3 -4.5,2.8; 4 -1.5,2.8; 5 1.5,2.8; 6 4.5,2.8; 7 7.5,2.8; 8 10.5,2.8; 9 10.5,5.8; 10 7.5,5.8; 11 4.5,5.8; 12 1.5,5.8; 13 -1.5,5.8; 14 -4.5,5.8; 15 -7.5,5.8; 16 -10.5,5.8 | hole 3: 8.35,-1.52; -8.35,-1.52
3-794618-2 = drill 1.02 pad 1.93: 1 0,2.8; 2 0,5.8 | hole 3: 0,-1.52
JST-4 = drill 0.7 pad 1.422: 1 -3,0; 2 -1,0; 3 1,0; 4 3,0
BT_BOARD_FOOTPRINT = drill 0.9 pad 1.778: GND -16.51,-1.27; RX -16.51,3.81; TX -16.51,1.27; VCC -16.51,-3.81
XBEE-SILK = drill 0.8 pad 1.524: 1 -11,20; 2 -11,18; 3 -11,16; 4 -11,14; 5 -11,12; 6 -11,10; 7 -11,8; 8 -11,6; 9 -11,4; 10 -11,2; 11 11,2; 12 11,4; 13 11,6; 14 11,8; 15 11,10; 16 11,12; 17 11,14; 18 11,16; 19 11,18; 20 11,20
JP2 = drill 0.914 long: 1 -2.54,0; 2 0,0; 3 2.54,0
G5V1 = drill 0.813 long: 1 -5.08,-2.54; 2 -2.54,-2.54; 5 5.08,-2.54; 6 5.08,2.54; 9 -2.54,2.54; 10 -5.08,2.54
VLS5045 = smd 4 x 1.5: 1 0,1.8; 2 0,-1.8
CHIP-LED0805 = smd 1.2 x 1.2: A 0,-1.05; C 0,1.05
SOT23 = smd 1 x 1.4: 1 -0.95,-1.1; 2 0.95,-1.1; 3 0,1.1
R0805 = smd 1.3 x 1.5: 1 -0.95,0; 2 0.95,0
RTRIM3224W = smd 1.3 x 1.6: 1 -1.25,-1.45; 3 1.25,-1.45 | smd 2 x 1.6: 2 0,1.45
FP24-2000 = drill 1.524 pad 3.81 long: 1 23.736,-27.686; 2 8.496,-27.686; 3 -23.736,-27.686; 4 -8.496,-27.686; 5 23.736,27.686; 6 8.496,27.686; 7 -23.736,27.686; 8 -8.496,27.686
SOT-23-6 = smd 0.55 x 1: 1 -0.95,-1.35; 2 0,-1.35; 3 0.95,-1.35; 4 0.95,1.35; 5 0,1.35; 6 -0.95,1.35
UA78XX = smd 5.55 x 6.15: COM 0,2.5 | smd 1 x 2.72: IN -2.29,-4.2; OUT 2.29,-4.2
ARDUINO_MKR = drill 1.016 pad 1.88: 1 -10.16,11.04; 2 -10.16,8.5; 3 -10.16,5.96; 4 -10.16,3.42; 5 -10.16,0.88; 6 -10.16,-1.66; 7 -10.16,-4.2; 8 -10.16,-6.74; 9 -10.16,-9.28; 10 -10.16,-11.82; 11 -10.16,-14.36; 12 -10.16,-16.9; 13 -10.16,-19.44; 14 -10.16,-21.98; 15 10.16,-21.98; 16 10.16,-19.44; 17 10.16,-16.9; 18 10.16,-14.36; 19 10.16,-11.82; 20 10.16,-9.28; 21 10.16,-6.74; 22 10.16,-4.2; 23 10.16,-1.66; 24 10.16,0.88; 25 10.16,3.42; 26 10.16,5.96; 27 10.16,8.5; 28 10.16,11.04
SOIC16_1 = smd 2 x 0.6: 1 -4.65,4.445; 2 -4.65,3.175; 3 -4.65,1.905; 4 -4.65,0.635; 5 -4.65,-0.635; 6 -4.65,-1.905; 7 -4.65,-3.175; 8 -4.65,-4.445; 9 4.65,-4.445; 10 4.65,-3.175; 11 4.65,-1.905; 12 4.65,-0.635; 13 4.65,0.635; 14 4.65,1.905; 15 4.65,3.175; 16 4.65,4.445

### Placement (x,y rotation side)
B1  21.5,69 90 top
C1  9.5,66 270 top
C2  102.5,81 90 top
C3  105.5,81 90 top
C4  112.5,85 180 top
C5  100.5,90 0 top
C6  100.5,87 0 top
C7  124.5,81 270 top
C8  158.5,37 90 top
C9  168.5,37 90 top
C10  9.5,53 0 top
CONN_1  3.2,86.7 90 top
F1  18.5,83.4 0 top
F2  18.5,92 0 top
FB1  174.5,36 0 top
IC1  107.5,36 270 top
IC2  95.5,30 0 top
IC3  133.5,25 0 top
IC4  144.5,25 0 top
IC5  155.5,25 0 top
IC6  141.5,37 0 top
IC7  95.5,39 0 top
IC8  95.5,47 0 top
J1  108,4.9 0 top
J2  27.5,5 0 top
J3  35.5,5 0 top
J4  43.5,5 0 top
J5  51.5,5 0 top
J6  184.5,90 90 top
J7  128.5,5 0 top
J8  136.5,5 0 top
J9  144.5,5 0 top
J10  152.5,5 0 top
J11  160.5,5 0 top
J12  72.5,5 0 top
J13  80.5,5 0 top
J_BT_BOARD_1  179.5,60 90 top
JP1  117.5,94 0 top
JP2  75.5,15 0 top
JP3  85.5,15 0 top
K1  33.5,25 90 top
K2  43.5,25 90 top
K3  53.5,25 90 top
K4  63.5,25 90 top
K5  75.5,25 90 top
K6  85.5,25 90 top
L1  96.5,83 180 top
LED1  175.5,99 0 top
LED2  182.5,99 0 top
Q1  121.5,36 180 top
Q2  121.5,51 180 top
Q3  131.5,36 180 top
Q4  131.5,51 180 top
Q5  175.5,88 0 top
R1  111.5,77 0 top
R2  121.5,86 90 top
R3  121.5,81 90 top
R4  117.5,81 270 top
R5  105.5,24 90 top
R6  110.5,24 90 top
R7  115.5,24 90 top
R8  120.5,24 90 top
R9  165.5,80 0 top
R10  165.5,83 0 top
R11  96.5,58 270 top
R13  121.5,44 180 top
R14  121.5,59 180 top
R15  131.5,44 180 top
R16  131.5,59 180 top
R17  121.5,41 0 top
R18  121.5,56 0 top
R19  131.5,41 0 top
R20  131.5,56 0 top
R21  116.5,44 0 top
R22  116.5,41 180 top
R23  116.5,59 0 top
R24  116.5,56 180 top
R25  126.5,44 0 top
R26  126.5,41 180 top
R27  126.5,59 0 top
R28  126.5,56 180 top
R29  129.5,18 180 top
R30  136.5,17 90 top
R31  140.5,17 90 top
R32  144.5,17 90 top
R33  148.5,17 90 top
R34  152.5,17 90 top
R35  175.5,84 180 top
R36  175.5,93 180 top
R37  175.5,81 180 top
R41  169.5,93 270 top
T1  57.5,81 180 top
U1  112.5,81 270 top
U2  163.5,40 0 top
U3  105.5,19 180 top
U4  110.5,19 180 top
U5  115.5,19 180 top
U6  120.5,19 180 top
U7  147.5,89 0 top
U8  104.64,57.35 90 top

### Tracks (layer width: path | path; a pad name or v marks a point on that pad's centre or on a via)
24VAC_1
  Bottom 1.27: J2.1 27.3,8
  Bottom 2.54: T1.5 26.81,53.31 18.5,45 18.5,20 23.5,15 23.5,10 25.5,8 27.3,8 | J5.1 J4.1 J3.1 J2.1
  Bottom 3: T1.5 33.76,61.74 29.04,66.46 B1.AC2
24VAC_2
  Bottom 3: K1.6 K1.5 K2.6 K2.5 K3.6 K3.5 K4.6 K4.5 81.24,45.28 T1.7
+3V3  (via drill 0.5)
  Top 0.508: U3.6 106.45,16.05 v106.5,16 | U4.6 111.45,16.05 v111.5,16 | U5.6 116.45,16.05 v116.5,16 | U6.6 121.45,16.05 v121.5,16 | IC1.14 112.69,39.81 v113.5,39 | IC6.1 135.77,33.93 v135.7,34 | R11.2 96.5,56 v97.5,55 | U8.16 v98.5,62 | R10.2 R9.2 v169.5,80
  SUPPLY 0.508: v106.5,16 107.5,15 110.5,15 v111.5,16 | v111.5,16 112.5,15 115.5,15 v116.5,16 117.5,15 120.5,15 v121.5,16 158.5,16 161.5,19 161.5,24 166.3,28.8 166.3,30 | J6.3 173.5,80 | 173.5,80 171.3,77.8 171.3,35.6 | 167.2,34.9 166.3,34 166.3,30 | v111.5,16 110.5,17 110.5,27 116.5,33 116.5,38 115.5,39 v113.5,39 113.5,44 111.5,46 111.5,47 113.5,49 113.5,51 112.5,52 100.5,52 v97.5,55 98.5,56 v98.5,62 | JP1.1 109.5,117 148.5,117 162.5,103 162.5,91 173.5,80 | v169.5,80 173.5,80 | v135.7,34 135.7,31.8 137.5,30 149.5,30 150.5,31 157.5,31 158.5,30 166.3,30
  other vias: 176.5,38 177.5,37 177.5,35
  pour SUPPLY (isolate 0.5): 88.5,122 171.5,122 171.5,105.5 189,105.5 189,35.5 187.5,34 172.5,34 170.5,32 170.5,28 167.5,25 165.5,25 163.5,23 163.5,19 159.5,15 123.5,15 121.5,13 103.5,13 102.5,14 102.5,20 88.5,34 88.5,62 90.5,64 103.5,64 106.5,61 106.5,57 107.5,56 116.5,56 118.5,54 118.5,21 122.5,17 155.5,17 156.5,18 156.5,26 154.5,28 136.5,28 133.5,31 133.5,36 134.5,37 137.5,37 138.5,36 138.5,33 139.5,32 161.5,32 162.5,33 162.5,102 158.5,106 91.5,106 88.5,109
  pour Top: 178.5,34 178.5,38 177.5,39 175,39 175,34.5 175.5,34
+5V  (via drill 0.5)
  Top 0.508: R36.2 172.5,93 171.55,92.05 R41.2 165.45,92.05 v164.5,93 | C8.1 158.75,35.8 U2.IN | R2.2 121.5,90 119.5,92 100.5,92 99.5,91 99.5,90.05 C5.1
  Top 1.27: J_BT_BOARD_1.VCC 183.31,34.81 180.5,32 v175.5,32.5 v172.5,32.5 162.5,32 161.21,33.29 U2.IN | L1.2 v96.5,88 96.5,89 97.5,90 C5.1 C6.1
  SUPPLY 0.508: K1.2 37.58,24 46.5,24 | 46.5,24 56.5,24 | 56.5,24 66.5,24 | 66.5,24 78.5,24 | 78.5,24 86.5,24 K6.2 93.5,17 93.5,6 98.35,6 98.5,6.15 107.95,6.15 J1.5 J1.6 J1.7 J1.8 121.2,7.7 126.5,13 163.5,13 174.5,24 174.5,29 v175.5,30.5 | K5.2 78.04,23.54 78.5,24 | K4.2 66.04,23.54 66.5,24 | K3.2 56.04,23.54 56.5,24 | K2.2 46.04,23.54 46.5,24 | 98.5,88 127.5,88 129.5,86 | 129.5,86 129.5,66 139.5,56 147.5,56 152.5,51 152.5,38 155.7,34.8 v156,33.8 | 129.5,86 132.5,89 132.5,101 134.5,103 149.5,103 155,97.5 U7.27
  Bottom 0.508: U7.27 163,97.5 164.5,96 v164.5,93
  other vias: 156,36 158.5,33.8 94.5,90 96.5,90 94.5,88 94.5,86.4 172.5,30.4 178.5,32.5 178.5,30.5
  pour Top: 99.5,84 94.5,84 93.5,85 93.5,90 94.5,91 99.5,91
  pour SUPPLY (isolate 0.5): 187.5,33 172.5,33 171.5,32 171.5,23 162.5,14 123.8,14 121.7,11.9 119.8,11.9 103,12 101.5,13.5 101.5,19.6 87.4,33.3 87.5,39 80.1,39 68.1,27 34.5,27 34.5,22 35.5,21 67.5,21 68.5,20 68.5,0 171.5,0 171.5,16.5 189,16.5 189,31.5
  pour SUPPLY (isolate 0.5): 160.5,35 158.5,33 140.5,33 139.5,34 139.5,37 138.5,38 134.5,38 130.5,42 130.5,58 110.5,78 90.5,78 88.5,80 88.5,102 90.5,104 156.5,104 160.5,99
  pour Top: 162.5,37 160.6,37 160.1,36.5 155,36.5 154.5,36 154.5,31.1 155.6,30 183.6,30 185.6,32 185.6,44 184.6,45 182.8,45 182.1,44.3 182.1,34.9 180.2,33 163.5,33 162.5,34
+12V  (via drill 0.5)
  Top 0.508: C2.1 C3.1 | C3.1 U1.3 | R1.1 106.5,77 105.5,78 C3.1 | R30.2 v136.5,20 | v140.5,20 R31.2 | v144.49,19.99 R32.2 | v148.5,20 R33.2 | v152.5,20 R34.2 | IC3.8 131.59,26.1 131.6,26.1 v131.6,26 | v153.5,26 153.59,26.09 IC5.8 | IC4.8 v142.59,25.01 v142.6,25 | R29.3 128.25,22.25 v127.5,23
  Top 1.016: C10.1 6.5,53 5.5,54 5.5,67 7.04,68.54 C1.+
  Top 2.54: 103.12,75.62 105.5,78
  SUPPLY 0.508: 152.5,25 v142.6,25 141.6,26 v131.6,26 130.5,26 v127.5,23 127.5,55 v109.5,73 | 152.5,25 v153.5,26 | 152.5,25 v152.5,20 v148.5,20 v144.5,20 v144.49,19.99 v140.51,19.99 v140.5,20 v136.5,20 | 102.88,75.62 v103.5,75
  Bottom 0.508: 140.5,20.1 v140.5,20 | 144.5,20.1 144.49,20.09 v144.49,19.99 | 148.5,20.1 v148.5,20 | 152.5,20.1 v152.5,20
  Bottom 3: C1.+ 17.58,76.62 B1.+
  other vias: 103.5,73 105.5,75 105.5,73 107.5,75 107.5,73 109.5,75
  pour Top: 101.5,80 110.5,80 110.5,73 109.5,72 102.5,72 101.5,73
  pour SUPPLY (isolate 0.5): 16.5,74 82.5,74 90.5,66 104.5,66 108.5,62 108.5,59 109.5,58 117.5,58 120.5,55 120.5,22 123.5,19 153.5,19 154.5,20 154.5,25 153.5,26 132.5,26 128.5,30 128.5,57 109.5,76 90.5,76 87.5,79 17.5,79 16.5,78
BT_RX
  Bottom 0.508: J_BT_BOARD_1.RX 175.69,83.81 172.16,87.34 U7.23
BT_TX
  Bottom 0.508: J_BT_BOARD_1.TX 178.23,41.73 177.5,41 174.5,41 173.5,42 173.5,82 170.7,84.8 U7.22
BTN1
  Top 0.508: J1.16 97.5,16 100.5,19 106.2,19 106.45,19.25 U3.1
BTN2
  Top 0.508: J1.15 100.5,14 101.5,15 107.5,15 108.5,16 108.5,18 109.5,19 111,19 111.45,19.45 U4.1
BTN3
  Top 0.508: J1.14 103.5,13 104.5,14 112.5,14 113.5,15 113.5,18 114.5,19 116,19 116.45,19.45 U5.1
BTN4
  Top 0.508: J1.13 106.5,12 107.5,13 116.5,13 118.5,15 118.5,18 119.5,19 121.1,19 121.45,19.35 U6.1
CLR1  (via drill 0.5)
  Top 0.508: U3.3 104.55,20.95 v103.5,22 103.5,24 104.5,25 105.45,25 R5.2 | v103.8,47.4 104.01,47.61 U8.4
  Bottom 0.508: v103.8,47.4 103.6,47.2 100.3,47.2 93.5,40.4 93.5,26.8 98.3,22 v103.5,22
CLR2  (via drill 0.5)
  Top 0.508: U4.3 109.55,20.95 v108.5,22 108.5,24 109.45,24.95 R6.2 | v105.5,47 105.28,47.22 U8.5
  Bottom 0.508: v108.5,22 107.5,23 98.7,23 94.5,27.2 94.5,39.9 100.7,46.1 104.6,46.1 v105.5,47
CLR3  (via drill 0.5)
  Top 0.508: U5.3 114.55,20.95 v113.5,22 113.5,24 114.45,24.95 R7.2 | U8.6 106.55,49.05 107,48.6 v107,47
  Bottom 0.508: v113.5,22 110.5,25 106.5,25 105.5,24 99.1,24 95.5,27.6 95.5,39.4 101.1,45 105.1,45 107,46.9 v107,47
CLR4  (via drill 0.5)
  Top 0.508: U6.3 119.55,20.95 v118.5,22 118.5,24 119.45,24.95 R8.2 | U8.7 107.82,49.32 108.5,48.64 v108.5,47
  Bottom 0.508: v118.5,22 118.5,24 116.5,26 105.5,26 104.5,25 99.5,25 96.5,28 96.5,39 101.5,44 105.5,44 v108.5,47
EXT_IO_INT
  Top 0.508: U8.13 104.01,59.51 103.45,58.95 R11.1 96.5,64 98.5,66 136.32,66 U7.14
EXT_IO_SCL  (via drill 0.5)
  Top 0.508: U7.21 161.76,82.26 162.5,83 R10.1 | U8.14 102.74,63.24 103.5,64 137.5,64 v138.5,63
  Bottom 0.508: U7.21 152.76,82.26 149.5,79 149.5,66 146.5,63 v138.5,63
EXT_IO_SDA  (via drill 0.5)
  Top 0.508: U7.20 157.94,80 R9.1 | U8.15 101.47,63.97 102.5,65 v138.5,65
  Bottom 0.508: v138.5,65 137.5,64 137.5,62.5 138.3,61.7 147.2,61.7 150.5,65 150.5,77 153.22,79.72 U7.20
FLS1  (via drill 0.5)
  Top 0.508: IC6.2 138.32,36.08 135.6,38.8 v135.6,41.8 | v145.7,43.9 145.7,92.4 143.14,94.96 U7.3
  Bottom 0.508: v135.6,41.8 135.6,43 136.5,43.9 v145.7,43.9
FLS2  (via drill 0.5)
  Top 0.508: IC6.4 140.87,35.36 v141.5,36 | v140.9,42.7 v140.9,65.8 | v140.9,81 140.9,91.4 139.88,92.42 U7.4
  Bottom 0.508: v141.5,36 140.9,36.6 v140.9,42.7 | v140.9,65.8 v140.9,81
FLS3  (via drill 0.5)
  Top 0.508: IC6.6 143.41,35.91 v143.5,36 | v143.4,42.7 v143.4,73.8 | v143.4,78.1 141.78,79.72 U7.9
  Bottom 0.508: v143.5,36 142.5,37 142.5,38 143.4,38.9 v143.4,42.7 | v143.4,73.8 v143.4,78.1
FLS4
  Top 0.508: IC6.10 144.68,74.83 142.32,77.18 U7.10
FLS5
  Top 0.508: IC6.12 142.13,67.36 139.94,69.56 U7.13
GND  (via drill 0.5)
  Top 0.508: R4.1 117.5,86 116.5,87 C6.2 | C6.2 C5.2 v103.5,90 | U1.1 C3.2 C2.2 101.45,83 C6.2 | IC3.4 135.6,22 v136.5,22 | v147.5,22 146.5,22 146.41,22.09 IC4.4 | v158.5,22 157.6,22 IC5.4 | U3.2 R5.1 106.85,23.05 107,22.9 v107,21.8 | U4.2 R6.1 111.85,23.05 112,22.9 v112,21.8 | U5.2 R7.1 116.85,23.05 117,22.9 v117,21.8 | U6.2 R8.1 121.85,23.05 122,22.9 v122,21.8 | IC1.7 104.43,30.07 v104.5,30 | Q2.2 R18.1 R24.1 117.5,55.95 117.5,54 119.3,52.2 119.3,50.1 120.1,49.3 v120.1,49.1 | Q4.2 R20.1 R28.1 127.45,53.95 v126.5,53 | Q3.2 R19.1 R26.1 127.45,37.95 v126.5,37 | R22.1 R17.1 Q1.2 119.5,36.05 v119.5,35 | U8.3 U8.2 U8.1 100.2,50.2 v100.1,50.1 | R29.1 130.75,20.95 v130.1,21.6 | R35.1 Q5.2 178.4,86.9 v178.5,87 | C9.2 168.5,41 167,42.5 U2.COM 160,42.5 158.5,41 C8.2 155.55,37.95 v155.5,38 | LED1.C 177.45,100.05 v177.5,100 | IC2.1 94.55,26.55 v93.2,25.2 | IC2.4 97.35,32.1 v97.5,32.1 | IC8.1 94.5,45.75 v94.5,44 | IC8.4 96.45,49.95 v96.5,50 | IC7.4 96.65,40 v99,40 | IC7.1 94.55,35.55 v92.3,33.3 | IC6.8 145.94,32.16 v146.5,31.6 | U8.8 109.09,51.11 v110.1,50.1
  Top 1.016: C10.2 10.45,62.51 C1.-
  Bottom 0.508: JP1.10 103.5,96 v102.5,97
  other vias: 161.5,44 163.5,44 165.5,44 161.5,42 163.5,42 165.5,42 161.5,40 163.5,40 165.5,40
  pour Ground (isolate 0.5): 17.5,122 171.5,122 171.5,112 171.5,109 arc90 175,105.5 189,105.5 189,22 189,16.5 177.5,16.5 175,16.5 arc90 171.5,13 171.5,5 171.5,0 165.5,0 17.5,0 17.5,7 17.5,13 arc90 14,16.5 6.7,16.5 0,16.5 0,24.4 0,105.5 4.9,105.5 14,105.5 arc90 17.5,109
  pour Top (isolate 0.5, rank 6): 91.5,122 171.5,122 171.5,117 171.5,109 arc90 175,105.5 179.1,105.5 189,105.5 189,96.3 189,16.5 180.5,16.5 175,16.5 arc90 171.5,13 171.5,5.7 171.5,0 165.2,0 69.8,0 68.5,1.3 68.5,28.3 76.2,36 85.7,45.5 85.7,51.9 85.7,120 87.7,122
  pour Bottom (isolate 0.5, rank 6): 87.7,122 171.5,122 171.5,109 arc90 175,105.5 189,105.5 189,16.5 175,16.5 arc90 171.5,13 171.5,0 69.8,0 68.5,1.3 68.5,28.3 85.7,45.5 85.7,120
GPS_RX
  Top 0.508: J6.1 182.5,85 182.5,73 176.52,67.02 U7.15
GPS_TX
  Top 0.508: J6.2 181.5,86 181.5,74 177.06,69.56 U7.16
IN_LED2_ON
  Top 0.508: R37.1 176.45,78.95 174.68,77.18 U7.19
LED1  (via drill 0.5)
  Top 0.508: v121.5,14.4 123.5,16.4 123.5,34 122.6,34.9 Q1.3
  Bottom 0.508: J1.12 109.5,13 110.5,14 112.5,14 113.1,14.6 121.3,14.6 v121.5,14.4
LED1_ON
  Top 0.508: Q1.1 R17.2 R13.1
LED2  (via drill 0.5)
  Top 0.508: v118.5,13.3 123.8,13.3 124.5,14 124.5,39.5 124.1,39.9 124.1,48.4 122.6,49.9 Q2.3
  Bottom 0.508: J1.11 112.5,12 113.5,13 118.2,13 v118.5,13.3
LED2_ON
  Top 0.508: R14.1 R18.2 Q2.1
LED3
  Top 0.508: J1.10 117.2,12.4 124.5,12.4 125.5,13.4 125.5,28.4 131.5,34.4 Q3.3
LED3_ON
  Top 0.508: R15.1 R19.2 Q3.1
LED4
  Top 0.508: J1.9 124.2,10.7 126.5,13 126.5,27.8 130.5,31.8 133.9,31.8 134.5,32.4 134.5,46 133.5,47 132.5,47 131.5,48 Q4.3
LED4_ON
  Top 0.508: R16.1 R20.2 Q4.1
N$1
  Bottom 3: T1.1 33.76,99.74 | 33.76,99.74 37.5,96 59.5,96 66,102.5 T1.4 | 33.76,99.74 33.76,87.26 29.9,83.4 F1.2
  pour Bottom: 19.5,85 20.5,86 29.5,86 31.5,88 31.5,112 32.5,113 40.5,113 41.5,112 41.5,103 43.5,101 56.5,101 58.5,103 58.5,111 60.5,113 72.5,113 73.5,112 73.5,104 75.5,102 82.5,102 83.5,101 83.5,93 82.5,92 39.5,92 38.5,91 38.5,81 37.5,80 21.5,80 19.5,82
N$2
  Bottom 3: T1.2 49,114.5 51.5,117 | 51.5,117 78.5,117 81.24,114.26 T1.3 | 51.5,117 31.5,117 28.5,114 28.5,97 23.5,92 F2.2
  pour Bottom: 20.5,96 20.5,116 23.5,119 80.5,119 83.5,116 83.5,105 82.5,104 76.5,104 75.5,105 75.5,114 74.5,115 58.5,115 56.5,113 56.5,105 54.5,103 44.5,103 43.5,104 43.5,113.4 41.6,115.5 32.1,115.5 29.8,113.3 29.8,96 23,89 19.5,89 19.5,95
N$3
  Bottom 3: T1.6 56.5,53.31 | 56.5,53.31 T1.8 | 56.5,53.31 56.5,63 47.96,71.54 B1.AC1
N$4
  Top 0.508: U1.6 114.95,81.95 115.5,82.5 115.5,84.4 114.9,85 C4.1
N$5  (via drill 0.5)
  Top 0.508: L1.1 v96.5,79 | v109.5,81 U1.2 | C4.2 v109.5,85
  Bottom 0.508: v96.5,79 96.5,78 97.5,77 102.5,77 103.5,78 103.5,80 | 103.5,80 104.5,81 v109.5,81 | v109.5,85 104.5,85 103.5,84 103.5,80
  pour Bottom: 94.5,82 101.5,82 102.5,83 102.5,86 103.5,87 109.5,87 110.5,86 110.5,80 106.5,76 94.5,76 93.5,77 93.5,81
N$6
  Top 0.2: U1.5 113.1,81 112.45,80.35 R1.2
N$7  (via drill 0.5)
  Top 0.508: U3.5 105.5,17 v104.5,16 | IC1.2 102.04,38.54 101.5,38 v101.5,20
  Bottom 0.508: v101.5,20 101.5,18 103.5,16 v104.5,16
N$8
  Top 0.508: C7.1 R3.2 R2.1
N$9
  Top 0.508: U1.4 R4.2 R3.1 C7.2
N$10  (via drill 0.5)
  Top 0.508: U4.5 110.5,17 v109.5,16 | IC1.5 105.77,34.73 106.5,34 106.5,29 107.5,28 v107.5,24
  Bottom 0.508: v107.5,24 108.6,24 109.5,23.1 v109.5,16
N$11  (via drill 0.5)
  Top 0.508: U5.5 115.5,17 v114.5,16 | IC1.10 109.23,34.73 108.5,34 108.5,29 109.5,28 111.5,28 112.6,26.9 v112.6,24.9
  Bottom 0.508: v114.5,16 114.5,23 v112.6,24.9
N$12  (via drill 0.5)
  Top 0.508: U6.5 120.5,17 v119.5,16 | v119.5,27 116.5,30 v110.5,30 | v107.5,31 107.5,37 109.04,38.54 IC1.13
  Bottom 0.508: v119.5,16 v119.5,27 | v110.5,30 109.5,31 v107.5,31
N$13  (via drill 0.5)
  Top 0.508: R13.2 R21.2 117.45,45.05 116.5,46 v113.5,46 | IC1.3 102.67,37.27 v102.6,37.2 | v100.3,37.2 100.3,41.2 99.8,41.7 95.9,41.7 95.5,41.3 IC7.5
  Bottom 0.508: v102.6,37.2 v100.3,37.2 100.3,41.3 102,43 110.5,43 v113.5,46
N$14
  Top 0.508: K1.9 35.5,27 88.5,27 90.5,29 90.5,33 92.5,35 92.5,39.15 93.55,40.2 IC7.6
N$15
  Bottom 3: CONN_1.1 F1.1
  pour Bottom: 16.5,86 7.5,86 6.5,85 6.5,81 7.5,80 16.5,80 17.5,81 17.5,85
N$16
  Top 0.508: K2.9 44.5,26 90.5,26 92.5,28 92.5,32 96.45,35.95 IC7.3
N$17  (via drill 0.5)
  Top 0.508: R25.2 128.9,44 | 128.9,44 R15.2 | v97.5,34 96.5,34 95.5,33 IC2.5 | v129,42.6 129,43.9 128.9,44 | IC1.8 115.31,32.19 v116.5,31
  Bottom 0.508: v97.5,34 99.5,32 110.5,32 111.5,31 v116.5,31 117.6,31 118.6,32 127.1,32 129,33.9 v129,42.6
N$18
  Top 0.508: K3.9 53.5,25 91.5,25 93.5,27 93.5,30.15 IC2.6
N$19  (via drill 0.5)
  Top 0.508: R27.2 128.9,59 | 128.9,59 R16.2 | v108.5,36 IC1.11 115.5,36 v117.9,33.6 | IC2.2 95.5,29.6 95.9,30 98.2,30 98.5,30.3 v98.5,35 | v128.9,57.4 128.9,59
  Bottom 0.508: v108.5,36 99.5,36 v98.5,35 | v117.9,33.6 118.5,33 126.5,33 127.9,34.4 127.9,56.4 v128.9,57.4
N$20
  Top 0.508: K4.9 62.5,24 93.5,24 96.45,26.95 IC2.3
N$21  (via drill 0.5)
  Top 0.508: v75.5,32 77.9,34.4 89.3,34.4 90.6,35.7 90.6,41.1 91.8,42.3 91.8,46 91.8,46.45 91.8,47.3 92.7,48.2 IC8.6
  Bottom 0.508: K5.9 72.96,26.46 75.5,29 v75.5,32
N$22
  Bottom 1.016: JP2.1 K5.10
N$23
  Bottom 1.016: JP2.3 K5.1
N$24
  Bottom 1.27: J2.2 27.5,16.46 K1.10
N$25
  Bottom 1.27: J3.2 40.96,16.26 K2.10
N$26
  Bottom 1.27: J4.2 50.96,18.26 K3.10
N$27
  Bottom 1.27: J5.2 53.3,10.8 60.96,18.46 K4.10
N$28
  Top 0.508: J7.2 130.7,13 134.5,13 136.5,15 R30.1 134.75,16.05 134.13,16.66 IC3.3
N$29
  Top 0.508: J8.2 138.7,13 139.5,13 140.5,14 R31.1 140.35,16.2 139.1,16.2 138.5,16.8 138.5,23 135.41,26.09 IC3.5
N$30
  Top 0.508: J9.2 R32.1 145.85,16.05 146.5,16.7 146.5,19.5 145.13,20.87 IC4.3
N$31
  Top 0.508: J10.2 150.3,13 149.5,13 148.5,14 R33.1 149.65,16.05 150.3,16.7 150.3,22.4 146.41,26.3 IC4.5
N$32
  Top 0.508: J11.2 158.3,13 154.5,13 152.5,15 R34.1 155.25,16.05 156.13,16.94 IC5.3
N$33
  Top 0.508: IC3.1 131.59,23.7 130.2,25.1 130.2,30.1 131.1,31 138.7,31 139.59,31.89 IC6.3
N$34
  Top 0.508: IC3.7 132.87,29.27 133.6,30 139.1,30 140.7,31.6 141.2,31.6 142.13,32.53 IC6.5
N$35
  Top 0.508: IC6.7 144.68,31.98 143.7,31 142.4,31 141.2,29.8 141.2,21.4 141.7,20.9 142.3,20.9 142.59,21.2 IC4.1
N$36
  Top 0.508: IC4.7 143.87,29.27 144.6,30 147.3,30 148,30.7 148,36 145.94,38.05 IC6.9
N$37  (via drill 0.5)
  Top 0.508: IC5.1 153.59,23.91 152.4,25.1 v152.4,29.5 | v144.2,37.5 143.41,38.3 IC6.11
  Bottom 0.508: v152.4,29.5 152.4,36.5 151.4,37.5 v144.2,37.5
N$38
  Top 0.508: R36.1 176.5,93.05 176.5,95 179.45,97.95 LED2.A
N$39
  Top 0.508: Q5.3 177.6,89.1 178.5,90 178.5,95 179.5,96 183.5,96 184.5,97 184.5,99 183.45,100.05 LED2.C
N$40
  Top 0.508: R41.1 169.5,95 172.45,97.95 LED1.A
N$41
  Bottom 1.016: J12.1 75.5,10.8 JP2.2
N$42
  Top 1.016: K5.6 K5.5
  Bottom 1.016: K5.6 70.5,27.62 70.5,12.8 J12.2
N$43
  Bottom 1.016: J13.1 85.5,12.8 JP3.2
N$44
  Top 1.016: K6.6 K6.5
  Bottom 1.016: K6.6 82.58,30.08 80.5,28 J13.2
N$45
  Bottom 1.016: JP3.1 K6.10
N$46
  Bottom 1.016: JP3.3 K6.1
N$47  (via drill 0.5)
  Top 0.508: IC8.3 96.45,43.65 95.5,42.7 93.5,42.7 91.5,40.7 91.5,35.4 89.5,33.4 86.9,33.4 v85.5,32
  Bottom 0.508: K6.9 85.5,25 v85.5,32
N$48
  Top 0.508: Q5.1 R35.2 R37.2
N$49
  Bottom 3: CONN_1.2 F2.1
  pour Bottom: 16.5,95 7.5,95 6.5,94 6.5,90 7.5,89 16.5,89 17.5,90 17.5,94
N$50  (via drill 0.5)
  Top 0.508: R23.2 119.5,59 | 119.5,59 R14.2 | IC1.6 102.74,33.46 v102.7,33.5 | v100.3,33.5 100.3,35.2 98.6,36.9 98.6,38.7 98.3,39 95.8,39 95.5,38.7 IC7.2 | 119.5,59 119,58.5 v119,57.7
  Bottom 0.508: v100.3,33.5 v102.7,33.5 108.2,33.5 108.9,32.8 114.8,32.8 119,37 v119,57.7
N$53
  Top 0.508: C9.1 168.25,35.8
  Top 0.813: 168.25,35.8 U2.OUT | C9.1 173.5,36.05 FB1.1
  pour Top: 164.5,37 164.5,35 165.5,34 173.5,34 173.9,34.4 173.9,37 172.9,38 171.5,38 170,36.5 167.5,36.5 167,37
PUMP_OFF
  Top 0.508: IC8.2 95.5,46.6 95.9,47 97.1,47 97.7,47.6 97.7,51 95,53.7 95,64.2 97.9,67.1 133.1,67.1 133.6,67.6 133.6,70.6 135.1,72.1 U7.12 | U7.12
PUMP_ON
  Top 0.508: IC8.5 95.5,51.6 93.9,53.2 93.9,64.7 97.4,68.2 132,68.2 132.5,68.7 132.5,70.9 136.24,74.64 U7.11
SENSOR_VREF  (via drill 0.5)
  Top 0.508: R29.2 129.5,15 130.5,14 131.5,14 132.87,15.37 IC3.2 132.87,23.66 132.9,23.7 | 132.9,23.7 v132.9,23.8 | IC3.6 134.13,24.94 132.9,23.7 | IC4.2 143.87,23.53 v143.6,23.8 143.6,24.9 145.13,26.44 IC4.6 | v154.5,23.8 154.87,23.44 IC5.2
  Bottom 0.508: v132.9,23.8 v143.6,23.8 v154.5,23.8
V1_FB
  Top 0.508: R22.2 R21.1 113.5,44 112.5,45 112.5,56 111.5,57 107.5,57 105.28,59.22 U8.12
V2_FB
  Top 0.508: R24.2 R23.1 108.5,59 107.82,59.68 U8.10
V3_FB  (via drill 0.5)
  Top 0.508: R26.2 R25.1 125.5,44.05 v125.5,46 | U8.11 106.55,59.35 107.9,58 112.5,58 113.5,57 113.5,53 114.5,52 116.5,52 117.5,51 117.5,50 v120.5,47
  Bottom 0.508: v125.5,46 124.5,47 v120.5,47
V4_FB
  Top 0.508: R28.2 R27.1 125.55,59.95 124.5,61 113.5,61 112.5,60 109.5,60 109.09,60.41 U8.9
VDIG1  (via drill 0.5)
  Top 0.508: IC1.1 106.31,39.81 v106.5,40
  Bottom 0.508: v106.5,40 114.5,40 115.5,41 115.5,64 116.5,65 128.5,65 129.5,66 129.5,83 133.84,87.34 U7.6
VDIG2  (via drill 0.5)
  Top 0.508: IC1.4 106.2,36 106.4,36.2 106.4,37.5 108.2,39.3 v108.2,41.6
  Bottom 0.508: v108.2,41.6 114.1,41.6 114.5,42 114.5,65 115.5,66 127.5,66 128.5,67 128.5,84 134.38,89.88 U7.5
VDIG3  (via drill 0.5)
  Top 0.508: IC1.9 113.96,33.46 v114.5,34
  Bottom 0.508: v114.5,34 117.5,37 117.5,62 118.5,63 130.5,63 131.5,64 131.5,80 133.76,82.26 U7.8
VDIG4  (via drill 0.5)
  Top 0.508: IC1.12 v114.17,37.27
  Bottom 0.508: v114.17,37.27 114.77,37.27 116.5,39 116.5,63 117.5,64 129.5,64 130.5,65 130.5,82 132.5,84 132.76,84.26 133.3,84.8 U7.7
XB_RX
  Top 0.508: U7.17 155.4,72.1 152.5,75 152.5,114 149.5,117 119.5,117 112.5,110 JP1.3
XB_TX
  Top 0.508: U7.18 154.86,74.64 153.5,76 153.5,115 150.5,118 118.5,118 112.5,112 JP1.2